# Altium project РЕУН.468323.001_Плата управления.PrjPCB
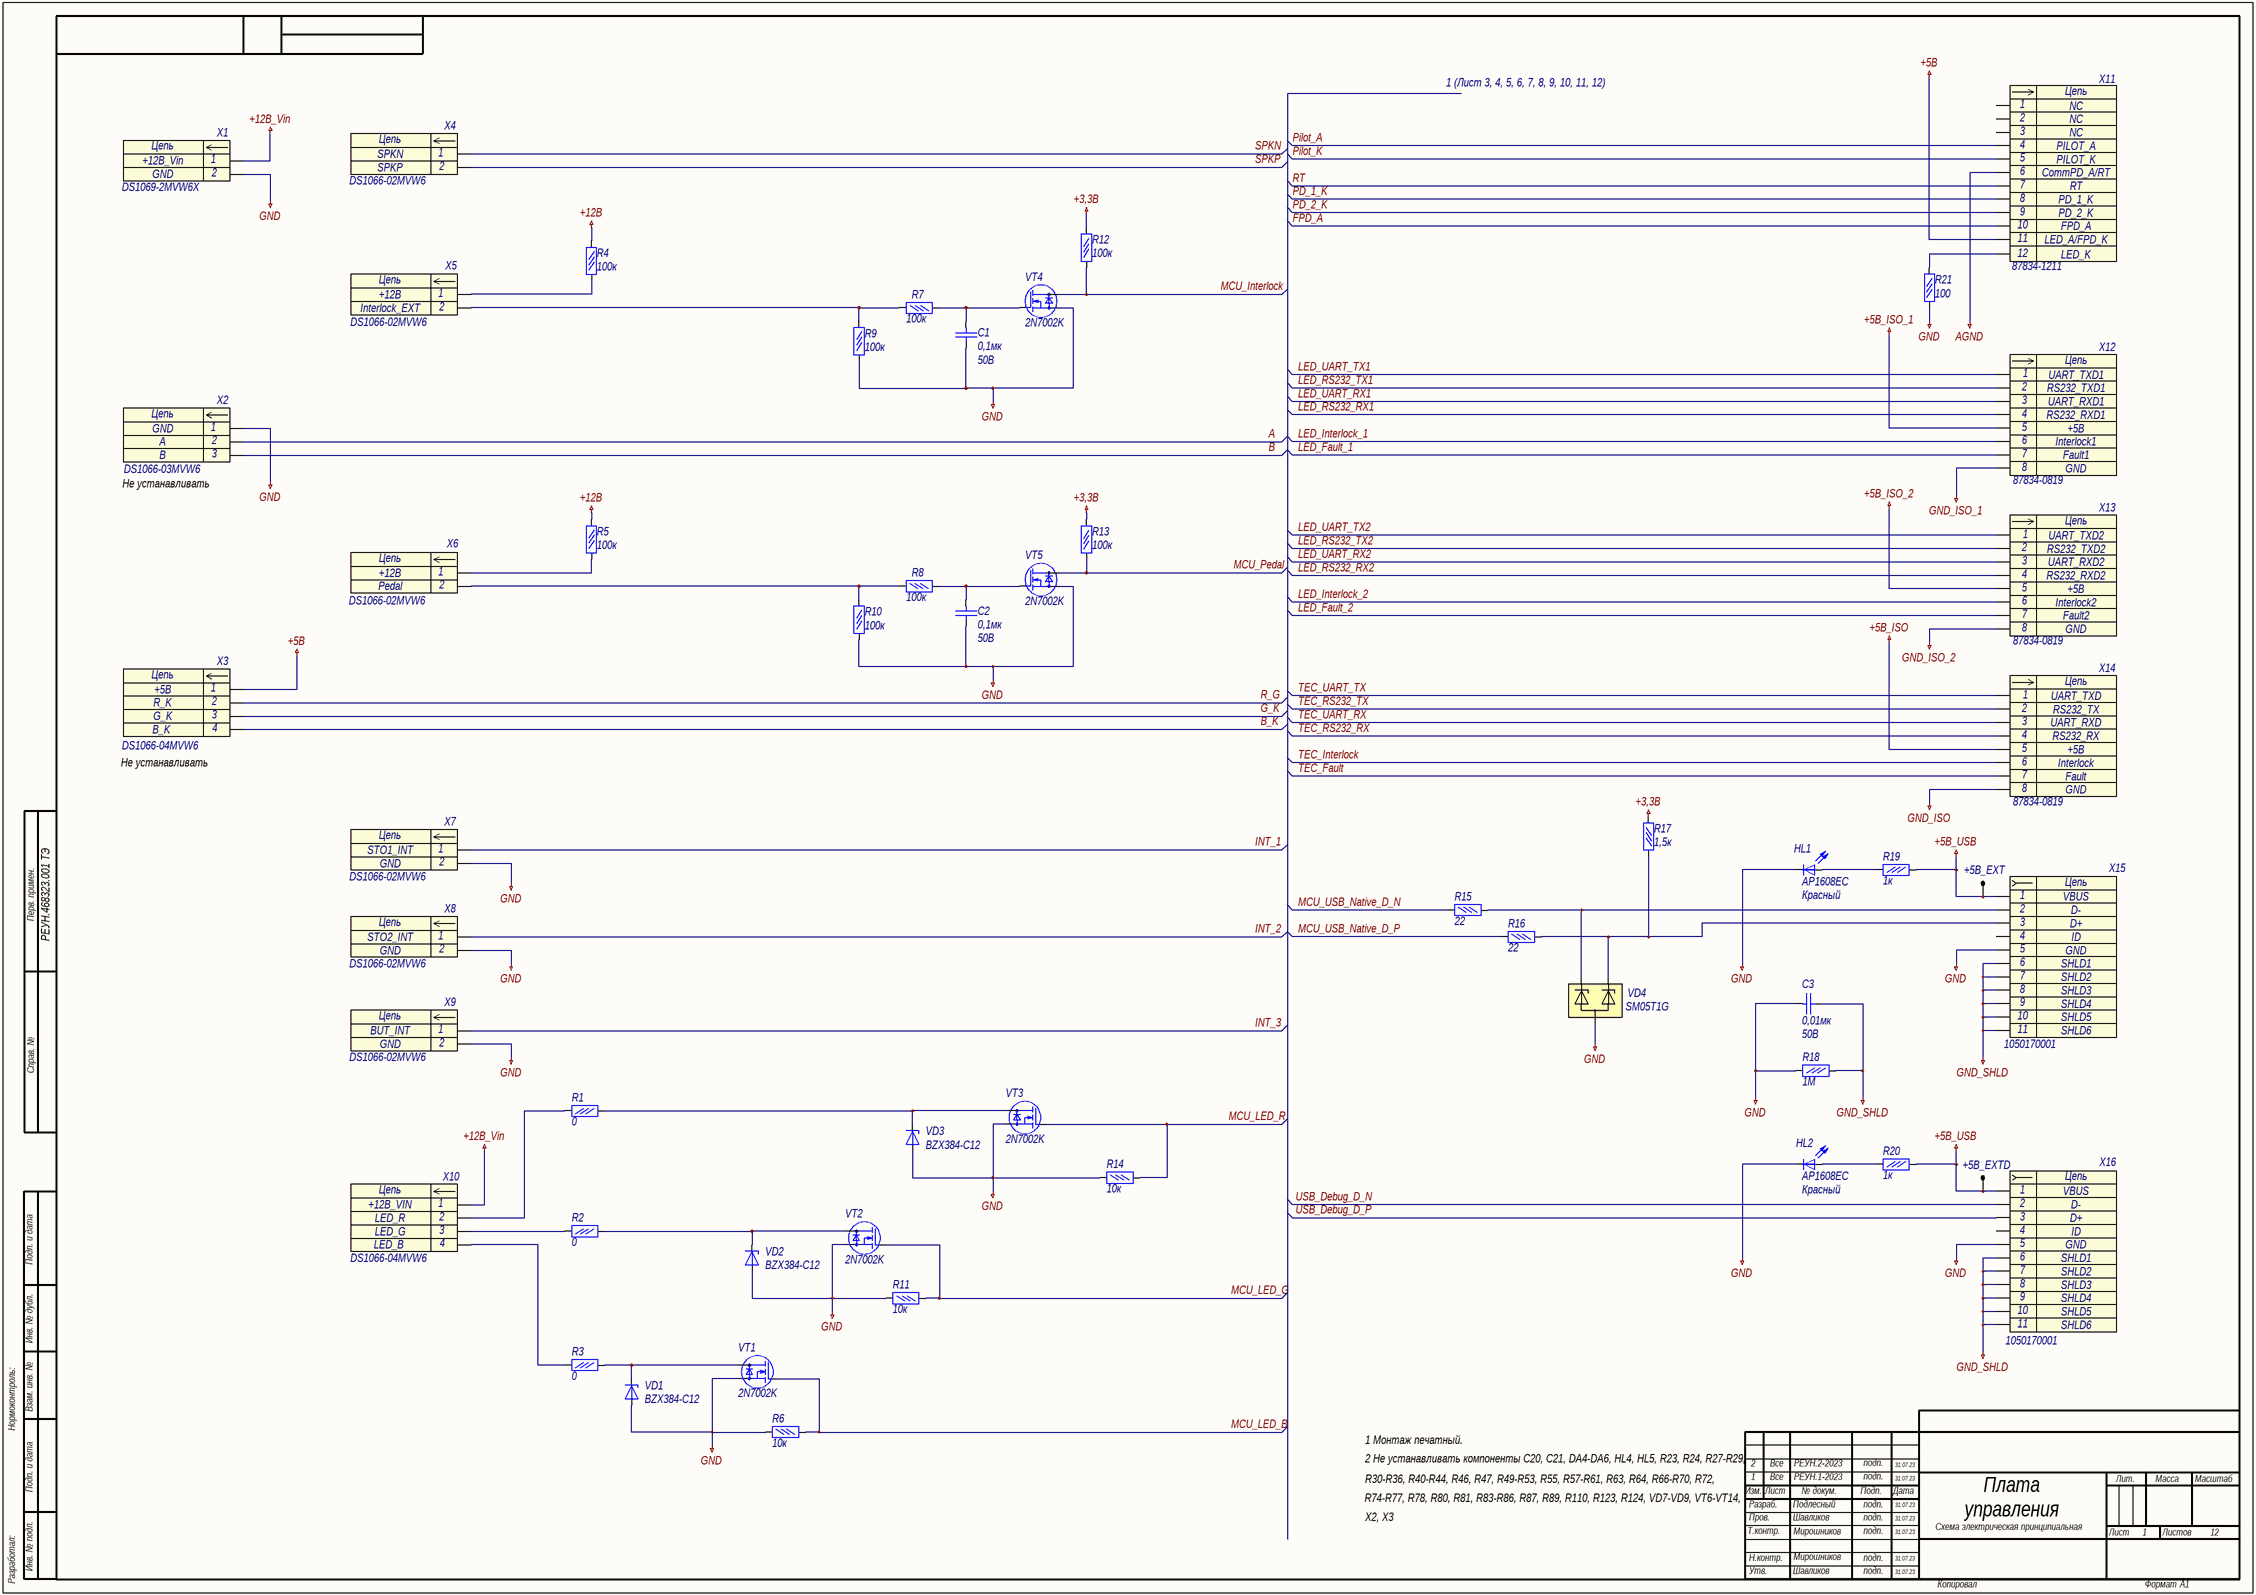
[diagram p0: РЕУН.468323.001_Connectors.SchDoc]
12 sheets, 278 parts. Net scope: global (net labels, ports and power ports of the same name join across sheets).
Sheets:
  РЕУН.468323.001_Connectors.SchDoc
  РЕУН.468323.001_Power.SchDoc
  РЕУН.468323.001_Interface.SchDoc
  РЕУН.468323.001_Encoder.SchDoc
  РЕУН.468323.001_Audio.SchDoc
  РЕУН.468323.001_LED_DRV_ISO_1.SchDoc
  РЕУН.468323.001_LED_DRV_ISO_2.SchDoc
  РЕУН.468323.001_LED_DRV_TEC.SchDoc
  РЕУН.468323.001_USB-UART.SchDoc
  РЕУН.468323.001_EEPROM.SchDoc
  РЕУН.468323.001_INT.SchDoc
  РЕУН.468323.001_Laser_Interface.SchDoc

## Sheet РЕУН.468323.001_Connectors.SchDoc: Плата
size 840 x 594 mm; ApprovedBy: Шавликов; CheckedBy: Шавликов; DrawnBy: Подлесный; SheetNumber: 1; SheetTotal: 12; Вид изделия: Документация; Раздел: Документация; Код документа: Э3; Вид документа: Схема электрическая принципиальная; Класс документа: Конструкторский документ; Создавать изделие в PLM: Yes; DocumentCode: РЕУН.468323.001 Э3 2D; DocumentView: Схема электрическая принципиальная; DocumentClass: Конструкторский документ; ProductView: Документация; DocName: Плата; Title_2: управления; DocumentType: Схема электрическая принципиальная; Format: А1; ImagePath: РЕУН.468323.001 ТЭ

### Parts
+5В_EXT  "1"  [0.5 x 1_round]  (value not drawn)
+5В_EXTD  "1"  [0.5 x 1_round]  (value not drawn)
C1  Voltage: 50В  [C0805_AA]  (hidden comment: 0,1мк)
C2  Voltage: 50В  [C0805_AA]  (hidden comment: 0,1мк)
C3  Voltage: 50В  [C0805_AA]  (hidden comment: 0,01мк)
HL1  Color: Красный  (hidden comment: AP1608EC)
HL2  Color: Красный  (hidden comment: AP1608EC)
R1  0  [R1206]
R2  0  [R1206]
R3  0  [R1206]
R4  100к  [R1206]
R5  100к  [R1206]
R6  10к  [R1206]
R7  100к  [R1206]
R8  100к  [R1206]
R9  100к  [R1206]
R10  100к  [R1206]
R11  10к  [R1206]
R12  100к  [R1206]
R13  100к  [R1206]
R14  10к  [R1206]
R15  22  [R1206]
R16  22  [R1206]
R17  1,5к  [R1206]
R18  1M  [R1206]
R19  1к  [R1206]
R20  1к  [R1206]
R21  100  [R1206]
VD1  BZX384-C12  [SOT23-2_A]
VD2  BZX384-C12  [SOT23-2_A]
VD3  BZX384-C12  [SOT23-2_A]
VD4  SM05T1G
VT1  2N7002K  [SOT23-3]
VT2  2N7002K  [SOT23-3]
VT3  2N7002K  [SOT23-3]
VT4  2N7002K  [SOT23-3]
VT5  2N7002K  [SOT23-3]
X1  DS1069-2MVW6X
X2  DS1066-03MVW6
X3  DS1066-04MVW6
X4  DS1066-02MVW6
X5  DS1066-02MVW6
X6  DS1066-02MVW6
X7  DS1066-02MVW6
X8  DS1066-02MVW6
X9  DS1066-02MVW6
X10  DS1066-04MVW6
X11  87834-1211
X12  87834-0819
X13  87834-0819
X14  87834-0819
X15  1050170001
X16  1050170001

### Nets
+3,3В: R12.1 R13.1 R17.2
+5В: X3.1 X11.10
+5В_ISO: X14.5
+5В_ISO_1: X12.5
+5В_ISO_2: X13.5
+5В_USB: +5В_EXT.1 +5В_EXTD.1 R19.2 R20.2 X15.1 X16.1
+12В: R4.2 R5.2
+12В_Vin: X1.1 X10.1
AGND: X11.6
GND: C1.1 C2.1 C3.2 HL1.2(K) HL2.2(K) R6.1 R9.1 R10.1 R11.2 R14.1 R18.1 R21.2 VD1.2(A) VD2.2(A) VD3.2(A) VD4.3 VT1.2(S) VT2.2(S) VT3.2(S) VT4.2(S) VT5.2(S) X1.2 X2.1 X7.2 X8.2 X9.2 X15.5 X16.5
GND_ISO: X14.8
GND_ISO_1: X12.8
GND_ISO_2: X13.8
GND_SHLD: C3.1 R18.2 X15.6 X15.7 X15.8 X15.9 X15.10 X16.6 X16.7 X16.8 X16.9 X16.10
A: X2.2
B: X2.2
B_K: X3.2
FPD_A: X11.10
G_K: X3.2
INT_1: X7.1
INT_2: X8.1
INT_3: X9.1
LED_Fault_1: X12.7
LED_Fault_2: X13.7
LED_Interlock_1: X12.6
LED_Interlock_2: X13.6
LED_RS232_RX1: X12.4
LED_RS232_RX2: X13.4
LED_RS232_TX1: X12.2
LED_RS232_TX2: X13.2
LED_UART_RX1: X12.3
LED_UART_RX2: X13.3
LED_UART_TX1: X12.1
LED_UART_TX2: X13.1
MCU_Interlock: R12.2 VT4.3(D)
MCU_LED_B: R6.2 VT1.1(G)
MCU_LED_G: R11.1 VT2.1(G)
MCU_LED_R: R14.2 VT3.1(G)
MCU_Pedal: R13.2 VT5.3(D)
MCU_USB_Native_D_N: R15.1
MCU_USB_Native_D_P: R16.1
PD_1_K: X11.8
PD_2_K: X11.9
Pilot_A: X11.4
Pilot_K: X11.5
R_G: X3.2
RT: X11.7
SPKN: X4.1
SPKP: X4.2
TEC_Fault: X14.7
TEC_Interlock: X14.6
TEC_RS232_RX: X14.4
TEC_RS232_TX: X14.2
TEC_UART_RX: X14.3
TEC_UART_TX: X14.1
USB_Debug_D_N: X16.2
USB_Debug_D_P: X16.3
NetC1_2: C1.2 R7.1 VT4.1(G)
NetC2_2: C2.2 R8.2 VT5.1(G)
NetHL1_1: HL1.1(A) R19.1
NetHL2_1: HL2.1(A) R20.1
NetR1_1: R1.1 VD3.1(K) VT3.3(D)
NetR1_2: R1.2 X10.2
NetR2_1: R2.1 VD2.1(K) VT2.3(D)
NetR2_2: R2.2 X10.2
NetR3_1: R3.1 VD1.1(K) VT1.3(D)
NetR3_2: R3.2 X10.2
NetR4_1: R4.1 X5.1
NetR5_1: R5.1 X6.1
NetR7_2: R7.2 R9.2 X5.2
NetR8_1: R8.1 R10.2 X6.2
NetR15_2: R15.2 VD4.1 X15.2
NetR16_2: R16.2 R17.1 VD4.2 X15.3
NetR21_1: R21.1 X11.10

Not connected (* = marked no-connect by the designer): X11 1 2 3; X15 4; X16 4

### Notes on the sheet
- 1 (Лист 3, 4, 5, 6, 7, 8, 9, 10, 11, 12)
- (near X2) Не устанавливать
- Не устанавливать
- 1 Монтаж печатный.
- 2 Не устанавливать компоненты C20, C21, DA4-DA6, HL4, HL5, R23, R24, R27-R29,
- 2
- Все
- РЕУН.2-2023
- подп.
- 31.07.23
- R74-R77, R78, R80, R81, R83-R86, R87, R89, R110, R123, R124, VD7-VD9, VT6-VT14,
- R30-R36, R40-R44, R46, R47, R49-R53, R55, R57-R61, R63, R64, R66-R70, R72,
- 1
- РЕУН.1-2023
- X2, X3
- Мирошников
- Перв. примен.
- Справ. №
- Подп. и дата
- Инв. № дубл.
- Нормоконтроль:
- Взам. инв. №
- Изм.
- Лист
- № докум.
- Подп.
- Дата
- Лит.
- Масса
- Масштаб
- Т.контр.
- Пров.
- Разраб.
- Листов
- Разработал:
- Инв. № подл.
- Н.контр.
- Утв.
- Копировал
- Формат
- (in symbol x8-m) Цепь
- (in symbol x8-m_1) Цепь
- (in symbol x8-m_1_1) Цепь
- (in symbol x8-m_1_1_1) Цепь
- (in symbol x10-m_1) Цепь; 11
- (in symbol x10-m_1_1) Цепь; 11; 12

### Library data of the parts
+5В_EXT +5В_EXTD = TestPoint: Test point; Comment_1: "1"
C1-C3 = Конденсатор кер.
  C1 C2: Value: 0,1мк
  C3: Value: 0,01мк
HL1 HL2 = led: Светодиод; Name: AP1608EC
R1-R21 = Резистор  0,05Вт: Резистор 0,05Вт; Power rating: 0,05Вт
  R1-R3: Value: 0
  R4 R5 R7-R10 R12 R13: Value: 100к
  R6 R11 R14: Value: 10к
  R15 R16: Value: 22
  R17: Value: 1,5к
  R18: Value: 1M
  R19 R20: Value: 1к
  R21: Value: 100
VD1-VD3 = DiodeZener: Стабилитрон; Name: BZX384-C12
VD4 = ZenerArray2: Сборка TVS-диодов
VT1-VT5 = mosfet-n: Name: 2N7002K
X1 = x8-m_1: Разъем - 8 конт. вилка; Contact_1: +12В_Vin; Contact_2: GND; Contact_3: Contact_3; Contact_4: Contact_4; Contact_5: Contact_5; Contact_6: Contact_6; Contact_7: Contact_7; Contact_8: Contact_8; Name: DS1069-2MVW6X
X2 = x8-m_1_1: Разъем - 8 конт. вилка; Contact_1: GND; Contact_2: A; Contact_3: B; Contact_4: Contact_4; Contact_5: Contact_5; Contact_6: Contact_6; Contact_7: Contact_7; Contact_8: Contact_8; Name: DS1066-03MVW6
X3 = x8-m_1_1_1: Разъем - 8 конт. вилка; Contact_1: +5В; Contact_2: R_K; Contact_3: G_K; Contact_4: B_K; Contact_5: Contact_5; Contact_6: Contact_6; Contact_7: Contact_7; Contact_8: Contact_8; Name: DS1066-04MVW6
X4 = x8-m_1: Разъем - 8 конт. вилка; Contact_1: SPKN; Contact_2: SPKP; Contact_3: Contact_3; Contact_4: Contact_4; Contact_5: Contact_5; Contact_6: Contact_6; Contact_7: Contact_7; Contact_8: Contact_8; Name: DS1066-02MVW6
X5 = x8-m_1: Разъем - 8 конт. вилка; Contact_1: +12В; Contact_2: Interlock_EXT; Contact_3: Contact_3; Contact_4: Contact_4; Contact_5: Contact_5; Contact_6: Contact_6; Contact_7: Contact_7; Contact_8: Contact_8; Name: DS1066-02MVW6
X6 = x8-m_1: Разъем - 8 конт. вилка; Contact_1: +12В; Contact_2: Pedal; Contact_3: Contact_3; Contact_4: Contact_4; Contact_5: Contact_5; Contact_6: Contact_6; Contact_7: Contact_7; Contact_8: Contact_8; Name: DS1066-02MVW6
X7 = x8-m_1: Разъем - 8 конт. вилка; Contact_1: STO1_INT; Contact_2: GND; Contact_3: Contact_3; Contact_4: Contact_4; Contact_5: Contact_5; Contact_6: Contact_6; Contact_7: Contact_7; Contact_8: Contact_8; Name: DS1066-02MVW6
X8 = x8-m_1: Разъем - 8 конт. вилка; Contact_1: STO2_INT; Contact_2: GND; Contact_3: Contact_3; Contact_4: Contact_4; Contact_5: Contact_5; Contact_6: Contact_6; Contact_7: Contact_7; Contact_8: Contact_8; Name: DS1066-02MVW6
X9 = x8-m_1: Разъем - 8 конт. вилка; Contact_1: BUT_INT; Contact_2: GND; Contact_3: Contact_3; Contact_4: Contact_4; Contact_5: Contact_5; Contact_6: Contact_6; Contact_7: Contact_7; Contact_8: Contact_8; Name: DS1066-02MVW6
X10 = x8-m_1_1_1: Разъем - 8 конт. вилка; Contact_1: +12В_VIN; Contact_2: LED_R; Contact_3: LED_G; Contact_4: LED_B; Contact_5: Contact_5; Contact_6: Contact_6; Contact_7: Contact_7; Contact_8: Contact_8; Name: DS1066-04MVW6
X11 = x10-m_1_1: Разъем - 10 конт. вилка; Contact_1: NC; Contact_4: PILOT_A; Contact_5: PILOT_K; Contact_6: CommPD_A/RT; Contact_7: RT; Contact_8: PD_1_K; Contact_9: PD_2_K; Contact_10: FPD_A; Contact_11: LED_A/FPD_K; Contact_12: LED_K; Contact_2: NC; Contact_3: NC; Name: 87834-1211
X12 = x8-m: Разъем - 8 конт. вилка; Contact_1: UART_TXD1; Contact_2: RS232_TXD1; Contact_3: UART_RXD1; Contact_4: RS232_RXD1; Contact_5: +5В; Contact_6: Interlock1; Contact_7: Fault1; Contact_8: GND; Name: 87834-0819
X13 = x8-m: Разъем - 8 конт. вилка; Contact_1: UART_TXD2; Contact_2: RS232_TXD2; Contact_3: UART_RXD2; Contact_4: RS232_RXD2; Contact_5: +5В; Contact_6: Interlock2; Contact_7: Fault2; Contact_8: GND; Name: 87834-0819
X14 = x8-m: Разъем - 8 конт. вилка; Contact_1: UART_TXD; Contact_2: RS232_TX; Contact_3: UART_RXD; Contact_4: RS232_RX; Contact_5: +5В; Contact_6: Interlock; Contact_7: Fault; Contact_8: GND; Name: 87834-0819
X15 X16 = x10-m_1: Разъем - 10 конт. вилка; Contact_1: VBUS; Contact_2: D-; Contact_3: D+; Contact_4: ID; Contact_5: GND; Contact_6: SHLD1; Contact_7: SHLD2; Contact_8: SHLD3; Contact_9: SHLD4; Contact_10: SHLD5; Contact_11: SHLD6; Name: 1050170001

## Sheet РЕУН.468323.001_Power.SchDoc: =Name-1str
size 420 x 297 mm; SheetNumber: 2; Вид изделия: Документация; Раздел: Документация; Код документа: РЕУН.468323.001Э3; Вид документа: Схема электрическая принципиальная; Класс документа: Конструкторский документ; Создавать изделие в PLM: Yes; DocumentCode: РЕУН.468323.001 Э3 2D; DocumentView: Схема электрическая принципиальная; DocumentClass: Конструкторский документ; ProductView: Документация; Format: А3
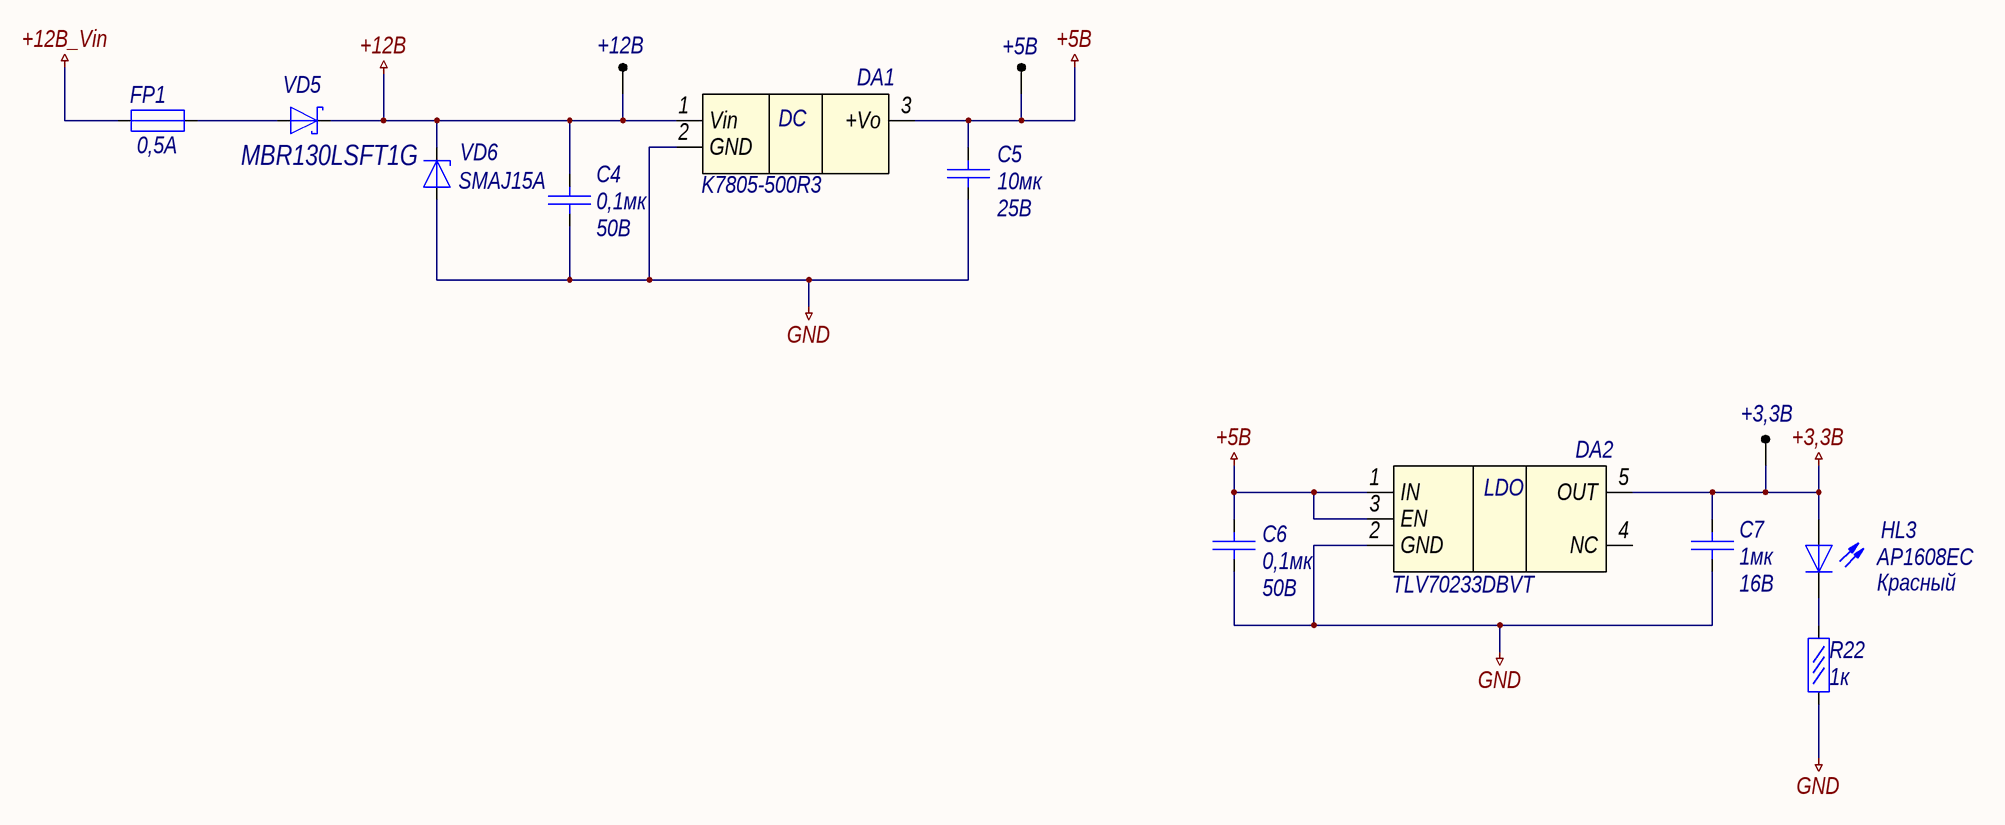
[diagram p1: РЕУН.468323.001_Power.SchDoc]

### Parts
+3,3В  "1"  [0.5 x 1_round]  (value not drawn)
+5В  "1"  [0.5 x 1_round]  (value not drawn)
+12В  "1"  [0.5 x 1_round]  (value not drawn)
C4  Voltage: 50В  [C0805_AA]  (hidden comment: 0,1мк)
C5  Voltage: 25В  [C0805_AA]  (hidden comment: 10мк)
C6  Voltage: 50В  [C0805_AA]  (hidden comment: 0,1мк)
C7  Voltage: 16В  [C0805_AA]  (hidden comment: 1мк)
DA1  K7805-500R3
DA2  TLV70233DBVT
FP1  value 0,5А  [R0805_H]
HL3  Vf: Красный  [D0603_A]  (hidden comment: AP1608EC)
R22  1к  [R1206]
VD5  MBR130LSFT1G  [SOD123_A]
VD6  SMAJ15A  [SOT23-2_A]

### Nets
+3,3В: +3,3В.1 C7.2 DA2.5(OUT) HL3.1(Анод)
+5В: +5В.1 C5.2 C6.2 DA1.3(+Vo) DA2.1(IN) DA2.3(EN)
+12В: +12В.1 C4.2 DA1.1(Vin) VD5.1(K) VD6.1(K)
+12В_Vin: FP1.1
GND: C4.1 C5.1 C6.1 C7.1 DA1.2(GND) DA2.2(GND) R22.1 VD6.2(A)
NetFP1_2: FP1.2 VD5.2(A)
NetHL3_2: HL3.2(Катод) R22.2

Not connected (* = marked no-connect by the designer): DA2 4(NC)

### Notes on the sheet
- Подп. и дата
- Инв. № дубл.
- Взам. инв. №
- Инв. № подл.
- Лист
- Изм.
- № докум.
- Подп.
- Дата
- Копировал
- Формат
- (in symbol K78xx-500R3) DC
- (in symbol TLV702) LDO

### Library data of the parts
+3,3В +5В +12В = TestPoint: Test point; Comment_1: "1"
C4-C7 = Конденсатор кер.
  C4 C6: Value: 0,1мк
  C5: Value: 10мк
  C7: Value: 1мк
DA1 = K78xx-500R3: DC/DC преобразователь неизолированный
DA2 = TLV702: LDO Regulator
FP1 = Fuse: Предохранитель
HL3 = LED_R: Светодиод; Name: AP1608EC
R22 = Резистор  0,05Вт: Резистор 0,05Вт; Power rating: 0,05Вт; Value: 1к
VD5 = DiodeSchottky: Диод Шоттки; Name: MBR130LSFT1G
VD6 = DiodeZener: Стабилитрон; Name: SMAJ15A

## Sheet РЕУН.468323.001_Interface.SchDoc: =Name-1str
size 840 x 594 mm; SheetNumber: 3; Вид изделия: Документация; Раздел: Документация; Код документа: Э3; Вид документа: Схема электрическая принципиальная; Класс документа: Конструкторский документ; Создавать изделие в PLM: Yes; DocumentCode: РЕУН.468323.001 Э3 2D; DocumentView: Схема электрическая принципиальная; DocumentClass: Конструкторский документ; ProductView: Документация; Format: А1
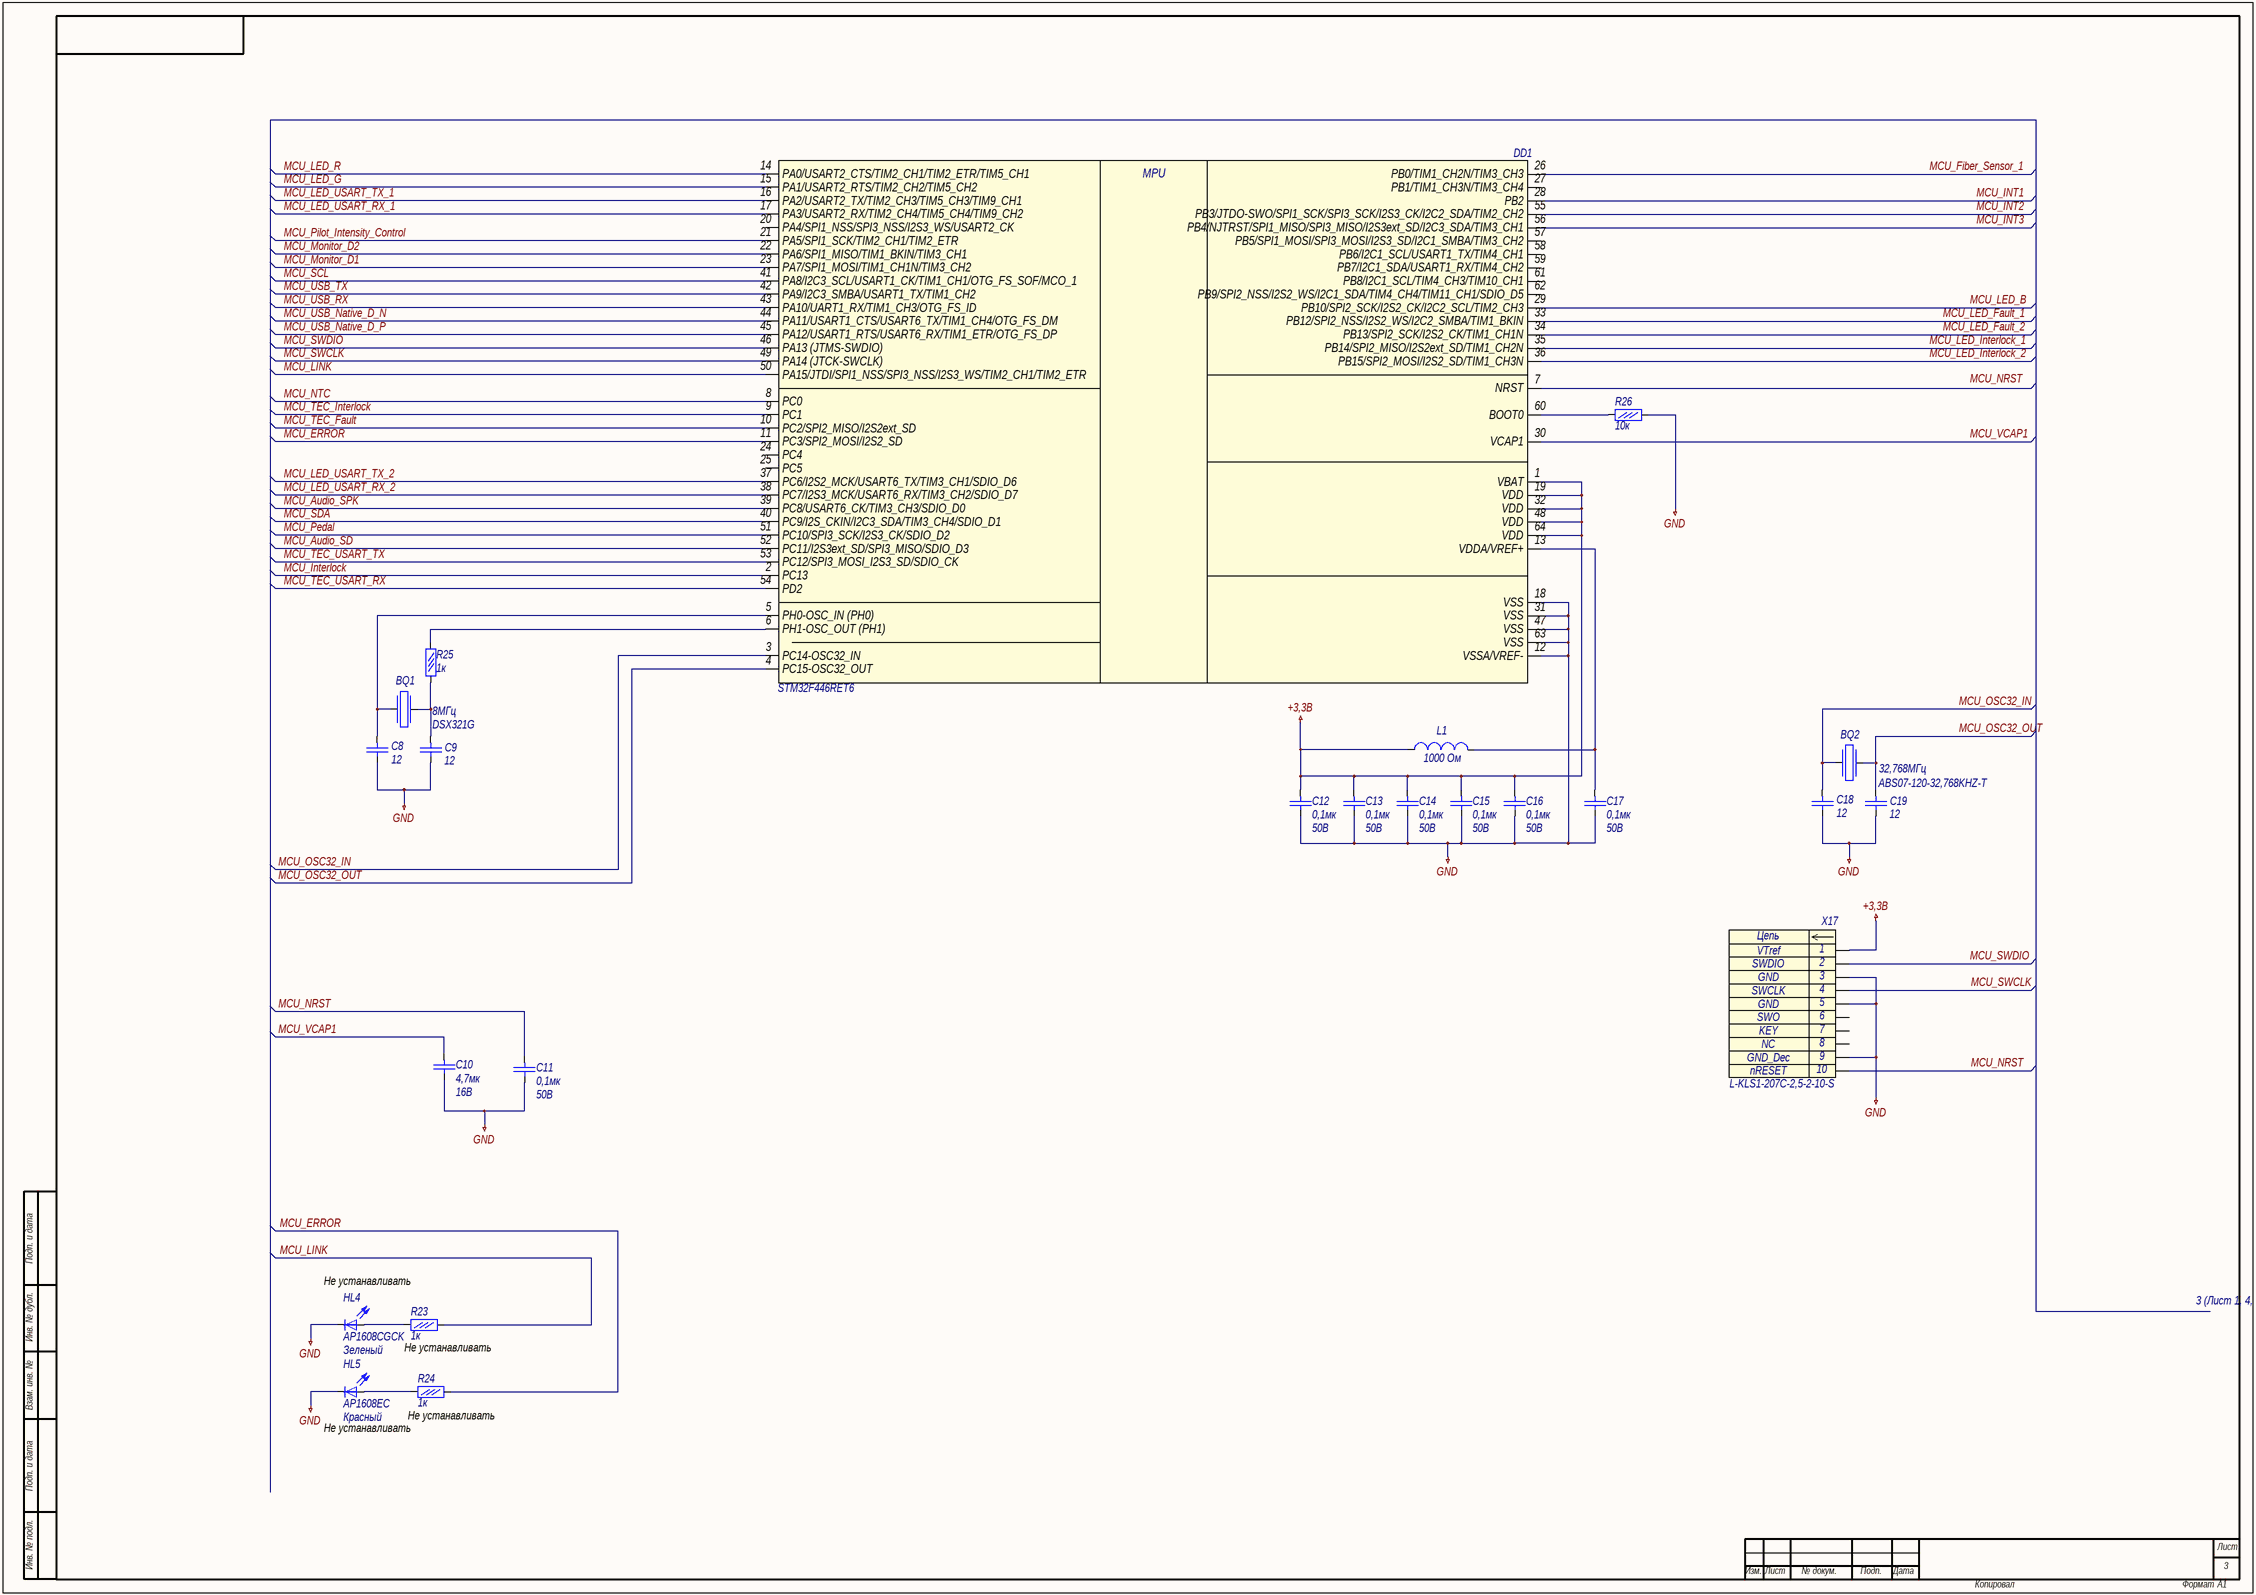
[diagram p2: РЕУН.468323.001_Interface.SchDoc]

### Parts
BQ1  Name: DSX321G  [QSMD3.2x2.5_A]  (hidden comment: 8МГц)
BQ2  Name: ABS07-120-32,768KHZ-T  [QSMD3.2x2.5_A]  (hidden comment: 32,768МГц)
C8  12  [C0805_AA]
C9  12  [C0805_AA]
C10  Voltage: 16В  [C0805_AA]  (hidden comment: 4,7мк)
C11  Voltage: 50В  [C0805_AA]  (hidden comment: 0,1мк)
C12  Voltage: 50В  [C0805_AA]  (hidden comment: 0,1мк)
C13  Voltage: 50В  [C0805_AA]  (hidden comment: 0,1мк)
C14  Voltage: 50В  [C0805_AA]  (hidden comment: 0,1мк)
C15  Voltage: 50В  [C0805_AA]  (hidden comment: 0,1мк)
C16  Voltage: 50В  [C0805_AA]  (hidden comment: 0,1мк)
C17  Voltage: 50В  [C0805_AA]  (hidden comment: 0,1мк)
C18  12  [C0805_AA]
C19  12  [C0805_AA]
DD1  STM32F446RET6
HL4  Color: Зеленый  (hidden comment: AP1608CGCK)
HL5  Color: Красный  (hidden comment: AP1608EC)
L1  1000 Ом  [L0603_A]
R23  1к  [R1206]
R24  1к  [R1206]
R25  1к  [R1206]
R26  10к  [R1206]
X17  L-KLS1-207C-2,5-2-10-S

### Nets
+3,3В: C12.2 C13.2 C14.2 C15.2 C16.2 DD1.1(VBAT) DD1.19(VDD) DD1.32(VDD) DD1.48(VDD) DD1.64(VDD) L1.1 X17.1
GND: C8.1 C9.1 C10.1 C11.1 C12.1 C13.1 C14.1 C15.1 C16.1 C17.1 C18.1 C19.1 DD1.12(VSSA/VREF-) DD1.18(VSS) DD1.31(VSS) DD1.47(VSS) DD1.63(VSS) HL4.2(K) HL5.2(K) R26.1 X17.3 X17.5 X17.9
MCU_Audio_SD: DD1.52(PC11/I2S3ext_SD/SPI3_MISO/SDIO_D3)
MCU_Audio_SPK: DD1.39(PC8/USART6_CK/TIM3_CH3/SDIO_D0)
MCU_ERROR: DD1.11(PC3/SPI2_MOSI/I2S2_SD) R24.1
MCU_Fiber_Sensor_1: DD1.26(PB0/TIM1_CH2N/TIM3_CH3)
MCU_INT1: DD1.28(PB2)
MCU_INT2: DD1.55(PB3/JTDO-SWO/SPI1_SCK/SPI3_SCK/I2S3_CK/I2C2_SDA/TIM2_CH2)
MCU_INT3: DD1.56(PB4/NJTRST/SPI1_MISO/SPI3_MISO/I2S3ext_SD/I2C3_SDA/TIM3_CH1)
MCU_Interlock: DD1.2(PC13)
MCU_LED_B: DD1.29(PB10/SPI2_SCK/I2S2_CK/I2C2_SCL/TIM2_CH3)
MCU_LED_Fault_1: DD1.33(PB12/SPI2_NSS/I2S2_WS/I2C2_SMBA/TIM1_BKIN)
MCU_LED_Fault_2: DD1.34(PB13/SPI2_SCK/I2S2_CK/TIM1_CH1N)
MCU_LED_G: DD1.15(PA1/USART2_RTS/TIM2_CH2/TIM5_CH2)
MCU_LED_Interlock_1: DD1.35(PB14/SPI2_MISO/I2S2ext_SD/TIM1_CH2N)
MCU_LED_Interlock_2: DD1.36(PB15/SPI2_MOSI/I2S2_SD/TIM1_CH3N)
MCU_LED_R: DD1.14(PA0/USART2_CTS/TIM2_CH1/TIM2_ETR/TIM5_CH1)
MCU_LED_USART_RX_1: DD1.17(PA3/USART2_RX/TIM2_CH4/TIM5_CH4/TIM9_CH2)
MCU_LED_USART_RX_2: DD1.38(PC7/I2S3_MCK/USART6_RX/TIM3_CH2/SDIO_D7)
MCU_LED_USART_TX_1: DD1.16(PA2/USART2_TX/TIM2_CH3/TIM5_CH3/TIM9_CH1)
MCU_LED_USART_TX_2: DD1.37(PC6/I2S2_MCK/USART6_TX/TIM3_CH1/SDIO_D6)
MCU_LINK: DD1.50(PA15/JTDI/SPI1_NSS/SPI3_NSS/I2S3_WS/TIM2_CH1/TIM2_ETR) R23.1
MCU_Monitor_D1: DD1.23(PA7/SPI1_MOSI/TIM1_CH1N/TIM3_CH2)
MCU_Monitor_D2: DD1.22(PA6/SPI1_MISO/TIM1_BKIN/TIM3_CH1)
MCU_NRST: C11.2 X17.10
MCU_NTC: DD1.8(PC0)
MCU_OSC32_IN: BQ2.2 C18.2 DD1.3(PC14-OSC32_IN)
MCU_OSC32_OUT: BQ2.1 C19.2 DD1.4(PC15-OSC32_OUT)
MCU_Pedal: DD1.51(PC10/SPI3_SCK/I2S3_CK/SDIO_D2)
MCU_Pilot_Intensity_Control: DD1.21(PA5/SPI1_SCK/TIM2_CH1/TIM2_ETR)
MCU_SCL: DD1.41(PA8/I2C3_SCL/USART1_CK/TIM1_CH1/OTG_FS_SOF/MCO_1)
MCU_SDA: DD1.40(PC9/I2S_CKIN/I2C3_SDA/TIM3_CH4/SDIO_D1)
MCU_SWCLK: DD1.49(PA14_(JTCK-SWCLK)) X17.4
MCU_SWDIO: DD1.46(PA13_(JTMS-SWDIO)) X17.2
MCU_TEC_Fault: DD1.10(PC2/SPI2_MISO/I2S2ext_SD)
MCU_TEC_Interlock: DD1.9(PC1)
MCU_TEC_USART_RX: DD1.54(PD2)
MCU_TEC_USART_TX: DD1.53(PC12/SPI3_MOSI_I2S3_SD/SDIO_CK)
MCU_USB_Native_D_N: DD1.44(PA11/USART1_CTS/USART6_TX/TIM1_CH4/OTG_FS_DM)
MCU_USB_Native_D_P: DD1.45(PA12/USART1_RTS/USART6_RX/TIM1_ETR/OTG_FS_DP)
MCU_USB_RX: DD1.43(PA10/UART1_RX/TIM1_CH3/OTG_FS_ID)
MCU_USB_TX: DD1.42(PA9/I2C3_SMBA/USART1_TX/TIM1_CH2)
MCU_VCAP1: C10.2 DD1.30(VCAP1)
NetBQ1_1: BQ1.1 C8.2 DD1.5(PH0-OSC_IN_(PH0))
NetBQ1_2: BQ1.2 C9.2 R25.1
NetC17_2: C17.2 DD1.13(VDDA/VREF+) L1.2
NetDD1_6: DD1.6(PH1-OSC_OUT_(PH1)) R25.2
NetDD1_60: DD1.60(BOOT0) R26.2
NetHL4_1: HL4.1(A) R23.2
NetHL5_1: HL5.1(A) R24.2

Not connected (* = marked no-connect by the designer): DD1 7(NRST) 20(PA4/SPI1_NSS/SPI3_NSS/I2S3_WS/USART2_CK) 24(PC4) 25(PC5) 27(PB1/TIM1_CH3N/TIM3_CH4) 57(PB5/SPI1_MOSI/SPI3_MOSI/I2S3_SD/I2C1_SMBA/TIM3_CH2) 58(PB6/I2C1_SCL/USART1_TX/TIM4_CH1) 59(PB7/I2C1_SDA/USART1_RX/TIM4_CH2) 61(PB8/I2C1_SCL/TIM4_CH3/TIM10_CH1) 62(PB9/SPI2_NSS/I2S2_WS/I2C1_SDA/TIM4_CH4/TIM11_CH1/SDIO_D5); X17 6 7 8

### Notes on the sheet
- Не устанавливать
- 3 (Лист 1, 4, 5, 6, 7, 8, 9, 10, 11, 12)
- (near R23) Не устанавливать
- (near R24) Не устанавливать
- Labels drawn without touching a wire or pin: MCU_NRST
- Подп. и дата
- Инв. № дубл.
- Взам. инв. №
- Инв. № подл.
- Лист
- Изм.
- № докум.
- Подп.
- Дата
- Копировал
- Формат
- (in symbol STM32F401RET6) MPU
- (in symbol x10-m) Цепь

### Library data of the parts
BQ1 BQ2 = Crystal: Кварцевый резонатор
  BQ1: Value: 8МГц
  BQ2: Value: 32,768МГц
C8-C19 = Конденсатор кер.
  C8 C9 C18 C19: Value: 12
  C10: Value: 4,7мк
  C11-C17: Value: 0,1мк
DD1 = STM32F401RET6: 32-битный микроконтроллер
HL4 HL5 = led: Светодиод
  HL4: Name: AP1608CGCK
  HL5: Name: AP1608EC
L1 = Inductor: Катушка индуктивности; Value: 1000 Ом
R23-R26 = Резистор  0,05Вт: Резистор 0,05Вт; Power rating: 0,05Вт
  R23-R25: Value: 1к
  R26: Value: 10к
X17 = x10-m: Разъем - 10 конт. вилка; Contact_1: VTref; Contact_2: SWDIO; Contact_3: GND; Contact_4: SWCLK; Contact_6: SWO; Contact_7: KEY; Contact_8: NC; Contact_9: GND_Dec; Contact_10: nRESET; Contact_5: GND; Name: L-KLS1-207C-2,5-2-10-S

## Sheet РЕУН.468323.001_Encoder.SchDoc: =Name-1str
size 420 x 297 mm; SheetNumber: 4; Вид изделия: Документация; Раздел: Документация; Код документа: Э3; Вид документа: Схема электрическая принципиальная; Класс документа: Конструкторский документ; Создавать изделие в PLM: Yes; DocumentCode: РЕУН.468323.001 Э3 2D; DocumentView: Схема электрическая принципиальная; DocumentClass: Конструкторский документ; ProductView: Документация; Format: А3
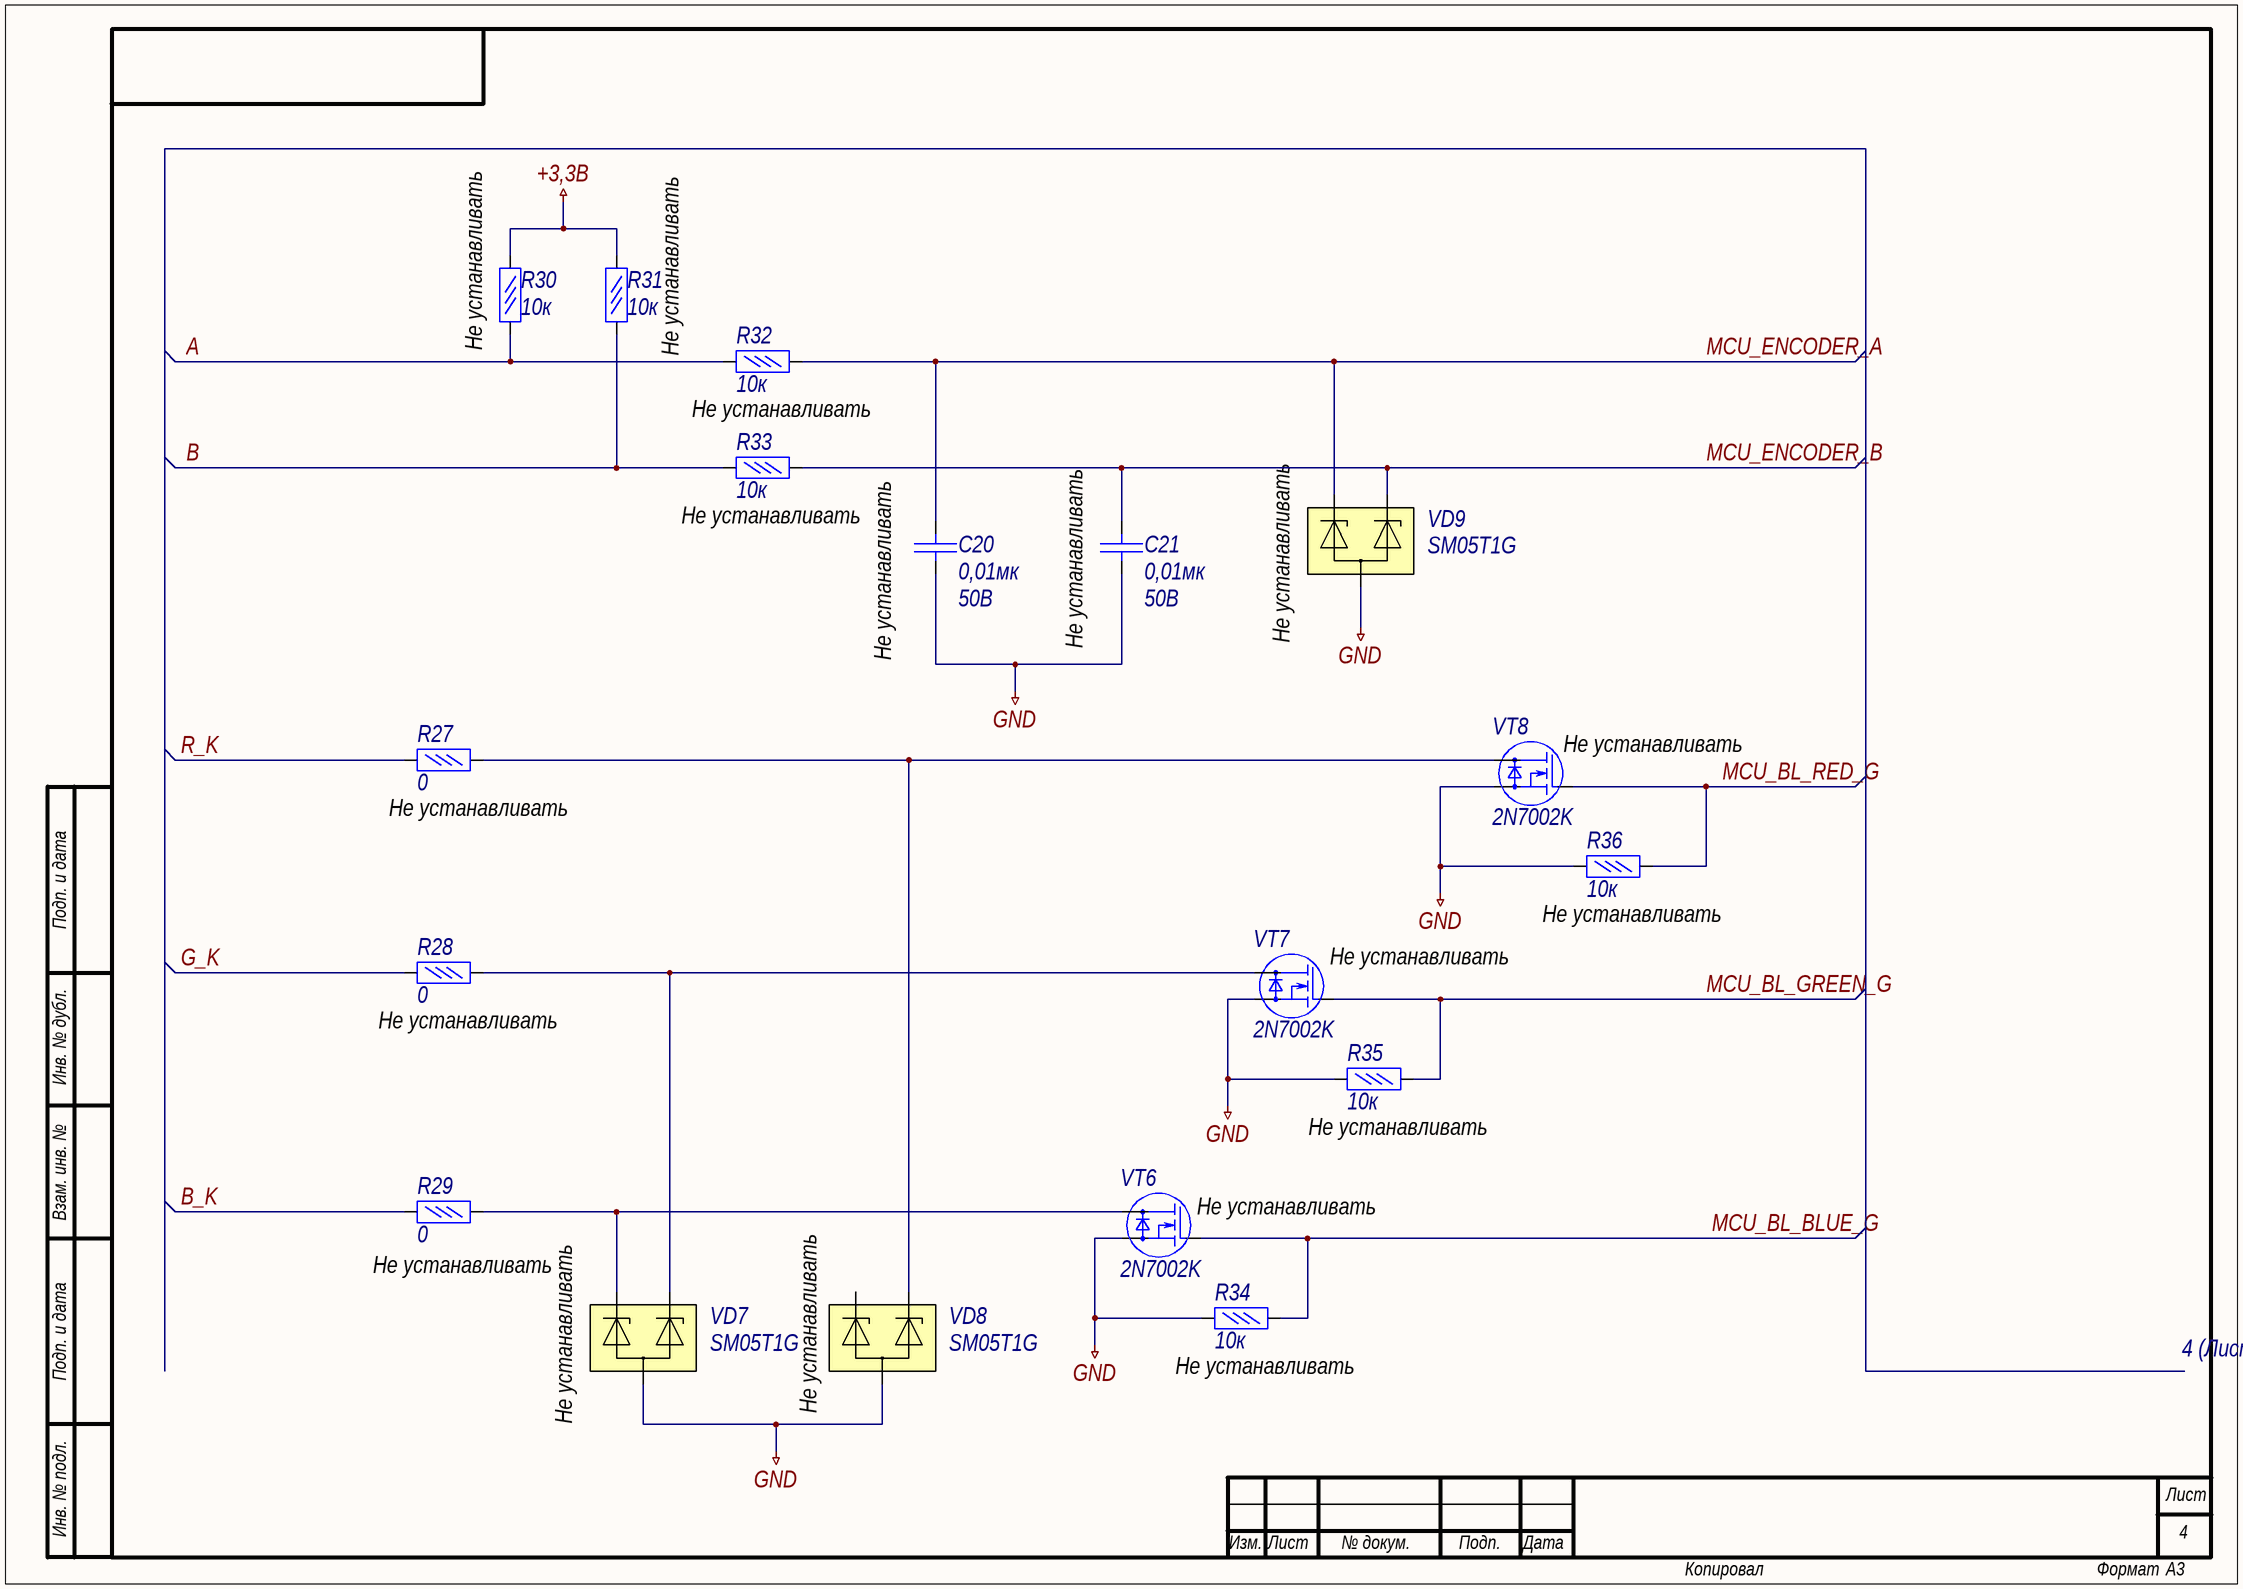
[diagram p3: РЕУН.468323.001_Encoder.SchDoc]

### Parts
C20  Voltage: 50В  [C0805_AA]  (hidden comment: 0,01мк)
C21  Voltage: 50В  [C0805_AA]  (hidden comment: 0,01мк)
R27  0  [R1206]
R28  0  [R1206]
R29  0  [R1206]
R30  10к  [R1206]
R31  10к  [R1206]
R32  10к  [R1206]
R33  10к  [R1206]
R34  10к  [R1206]
R35  10к  [R1206]
R36  10к  [R1206]
VD7  SM05T1G
VD8  SM05T1G
VD9  SM05T1G
VT6  2N7002K  [SOT23-3]
VT7  2N7002K  [SOT23-3]
VT8  2N7002K  [SOT23-3]

### Nets
+3,3В: R30.2 R31.2
GND: C20.1 C21.1 R34.1 R35.1 R36.1 VD7.3 VD8.3 VD9.3 VT6.2(S) VT7.2(S) VT8.2(S)
A: R30.1 R32.1
B: R31.1 R33.1
B_K: R29.1
G_K: R28.1
MCU_BL_BLUE_G: R34.2 VT6.1(G)
MCU_BL_GREEN_G: R35.2 VT7.1(G)
MCU_BL_RED_G: R36.2 VT8.1(G)
MCU_ENCODER_A: C20.2 R32.2 VD9.1
MCU_ENCODER_B: C21.2 R33.2 VD9.2
R_K: R27.1
NetR27_2: R27.2 VD8.2 VT8.3(D)
NetR28_2: R28.2 VD7.2 VT7.3(D)
NetR29_2: R29.2 VD7.1 VT6.3(D)

Not connected (* = marked no-connect by the designer): VD8 1

### Notes on the sheet
- (near R30) Не устанавливать
- Не устанавливать
- (near R33) Не устанавливать
- (near C20) Не устанавливать
- (near C21) Не устанавливать
- (near VD9) Не устанавливать
- (near VT8) Не устанавливать
- (near R27) Не устанавливать
- (near R36) Не устанавливать
- (near VT7) Не устанавливать
- (near R28) Не устанавливать
- (near R35) Не устанавливать
- (near VT6) Не устанавливать
- (near VD8) Не устанавливать
- (near R34) Не устанавливать
- 4 (Лист 1, 3, 5, 6, 7, 8, 9, 10, 11, 12)
- (near VD7) Не устанавливать
- Подп. и дата
- Инв. № дубл.
- Взам. инв. №
- Инв. № подл.
- Лист
- Изм.
- № докум.
- Подп.
- Дата
- Копировал
- Формат

### Library data of the parts
C20 C21 = Конденсатор кер.: Value: 0,01мк
R27-R36 = Резистор  0,05Вт: Резистор 0,05Вт; Power rating: 0,05Вт
  R27-R29: Value: 0
  R30-R36: Value: 10к
VD7-VD9 = ZenerArray2: Сборка TVS-диодов; Parameter 1: *
VT6-VT8 = mosfet-n: Name: 2N7002K

## Sheet РЕУН.468323.001_Audio.SchDoc: =Name-1str
size 420 x 297 mm; SheetNumber: 5; Вид изделия: Документация; Раздел: Документация; Код документа: Э3; Вид документа: Схема электрическая принципиальная; Класс документа: Конструкторский документ; Создавать изделие в PLM: Yes; DocumentCode: РЕУН.468323.001 Э3 2D; DocumentView: Схема электрическая принципиальная; DocumentClass: Конструкторский документ; ProductView: Документация; Format: А3
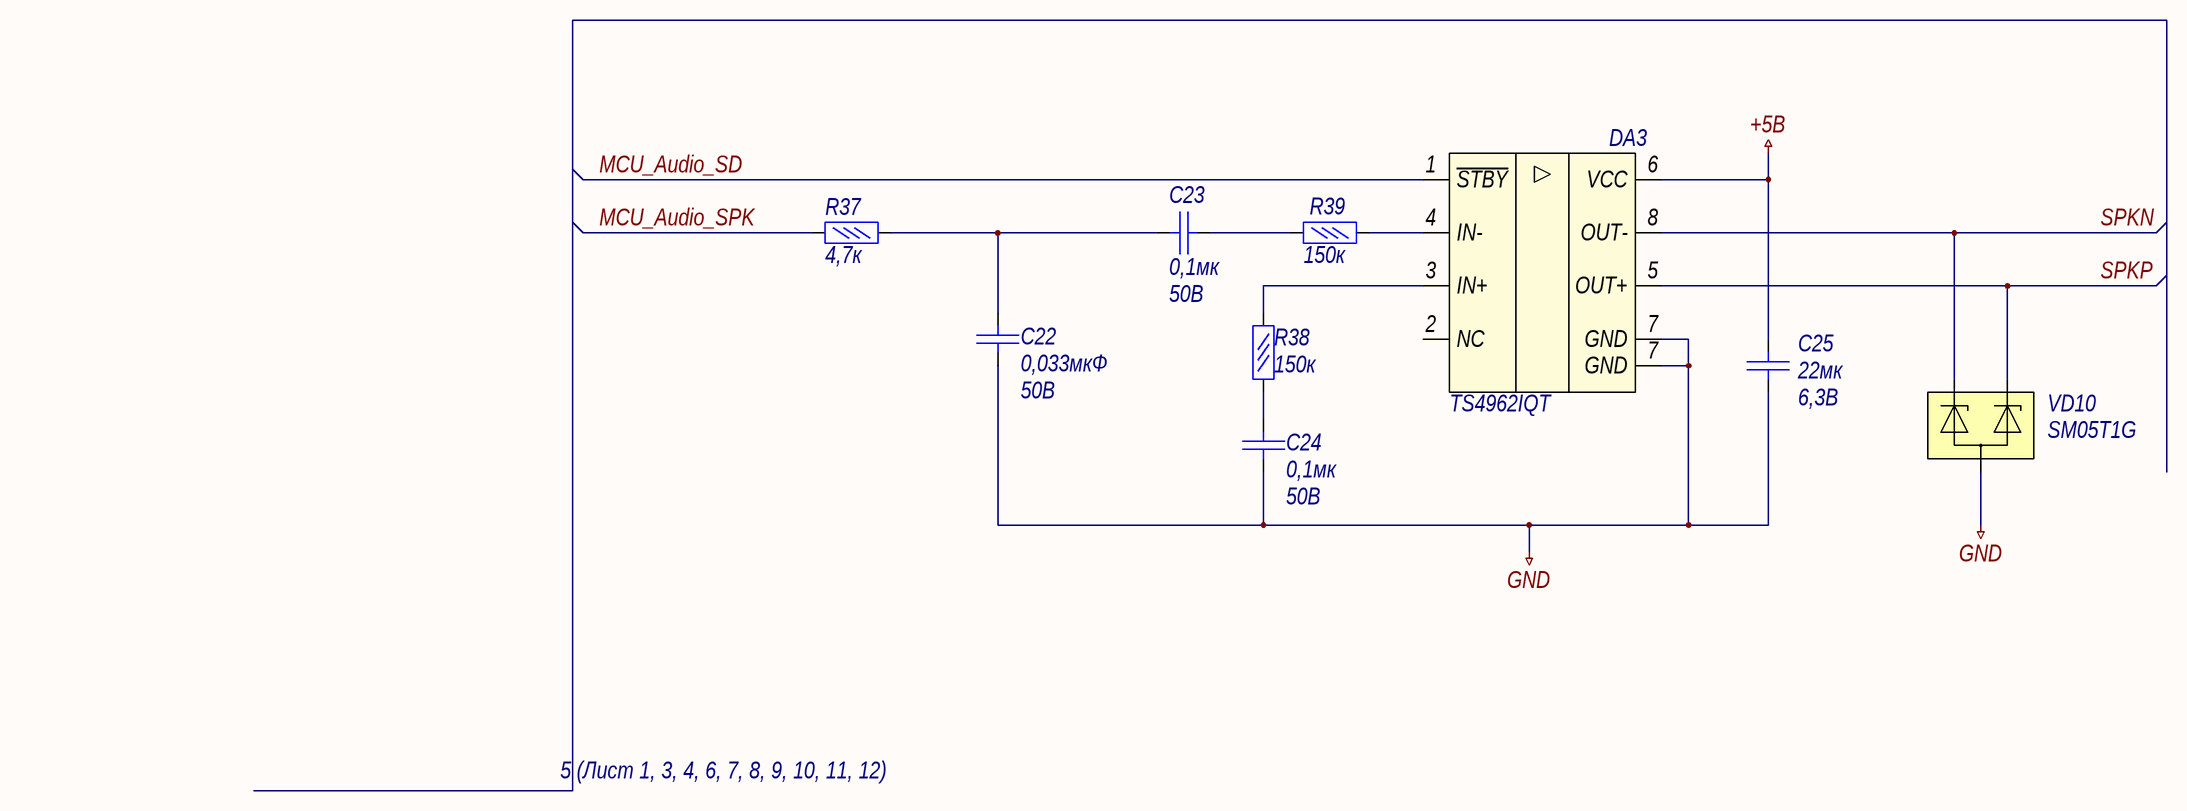
[diagram p4: РЕУН.468323.001_Audio.SchDoc]

### Parts
C22  Voltage: 50В  [C0805_AA]  (hidden comment: 0,033мкФ)
C23  Voltage: 50В  [C0805_AA]  (hidden comment: 0,1мк)
C24  Voltage: 50В  [C0805_AA]  (hidden comment: 0,1мк)
C25  Voltage: 6,3В  [C0805_AA]  (hidden comment: 22мк)
DA3  TS4962IQT
R37  4,7к  [R1206]
R38  150к  [R1206]
R39  150к  [R1206]
VD10  SM05T1G

### Nets
+5В: C25.2 DA3.6(VCC)
GND: C22.1 C24.1 C25.1 DA3.7(GND) VD10.3
MCU_Audio_SD: DA3.1(~{STBY})
MCU_Audio_SPK: R37.2
SPKN: DA3.8(OUT-) VD10.1
SPKP: DA3.5(OUT+) VD10.2
NetC22_2: C22.2 C23.2 R37.1
NetC23_1: C23.1 R39.2
NetC24_2: C24.2 R38.1
NetDA3_3: DA3.3(IN+) R38.2
NetDA3_4: DA3.4(IN-) R39.1

Not connected (* = marked no-connect by the designer): DA3 2(NC)

### Notes on the sheet
- 5 (Лист 1, 3, 4, 6, 7, 8, 9, 10, 11, 12)
- Подп. и дата
- Инв. № дубл.
- Взам. инв. №
- Инв. № подл.
- Лист
- Изм.
- № докум.
- Подп.
- Дата
- Копировал
- Формат

### Library data of the parts
C22-C25 = Конденсатор кер.
  C22: Value: 0,033мкФ
  C23 C24: Value: 0,1мк
  C25: Value: 22мк
DA3 = TS4962: Audio Power Amplifier
R37-R39 = Резистор  0,05Вт: Резистор 0,05Вт; Power rating: 0,05Вт
  R37: Value: 4,7к
  R38 R39: Value: 150к
VD10 = ZenerArray2: Сборка TVS-диодов; Parameter 1: *

## Sheet РЕУН.468323.001_LED_DRV_ISO_1.SchDoc: =Name-1str
size 594 x 420 mm; SheetNumber: 6; Вид изделия: Документация; Раздел: Документация; Код документа: Э3; Вид документа: Схема электрическая принципиальная; Класс документа: Конструкторский документ; Создавать изделие в PLM: Yes; DocumentCode: РЕУН.468323.001 Э3 2D; DocumentView: Схема электрическая принципиальная; DocumentClass: Конструкторский документ; ProductView: Документация; Format: А2
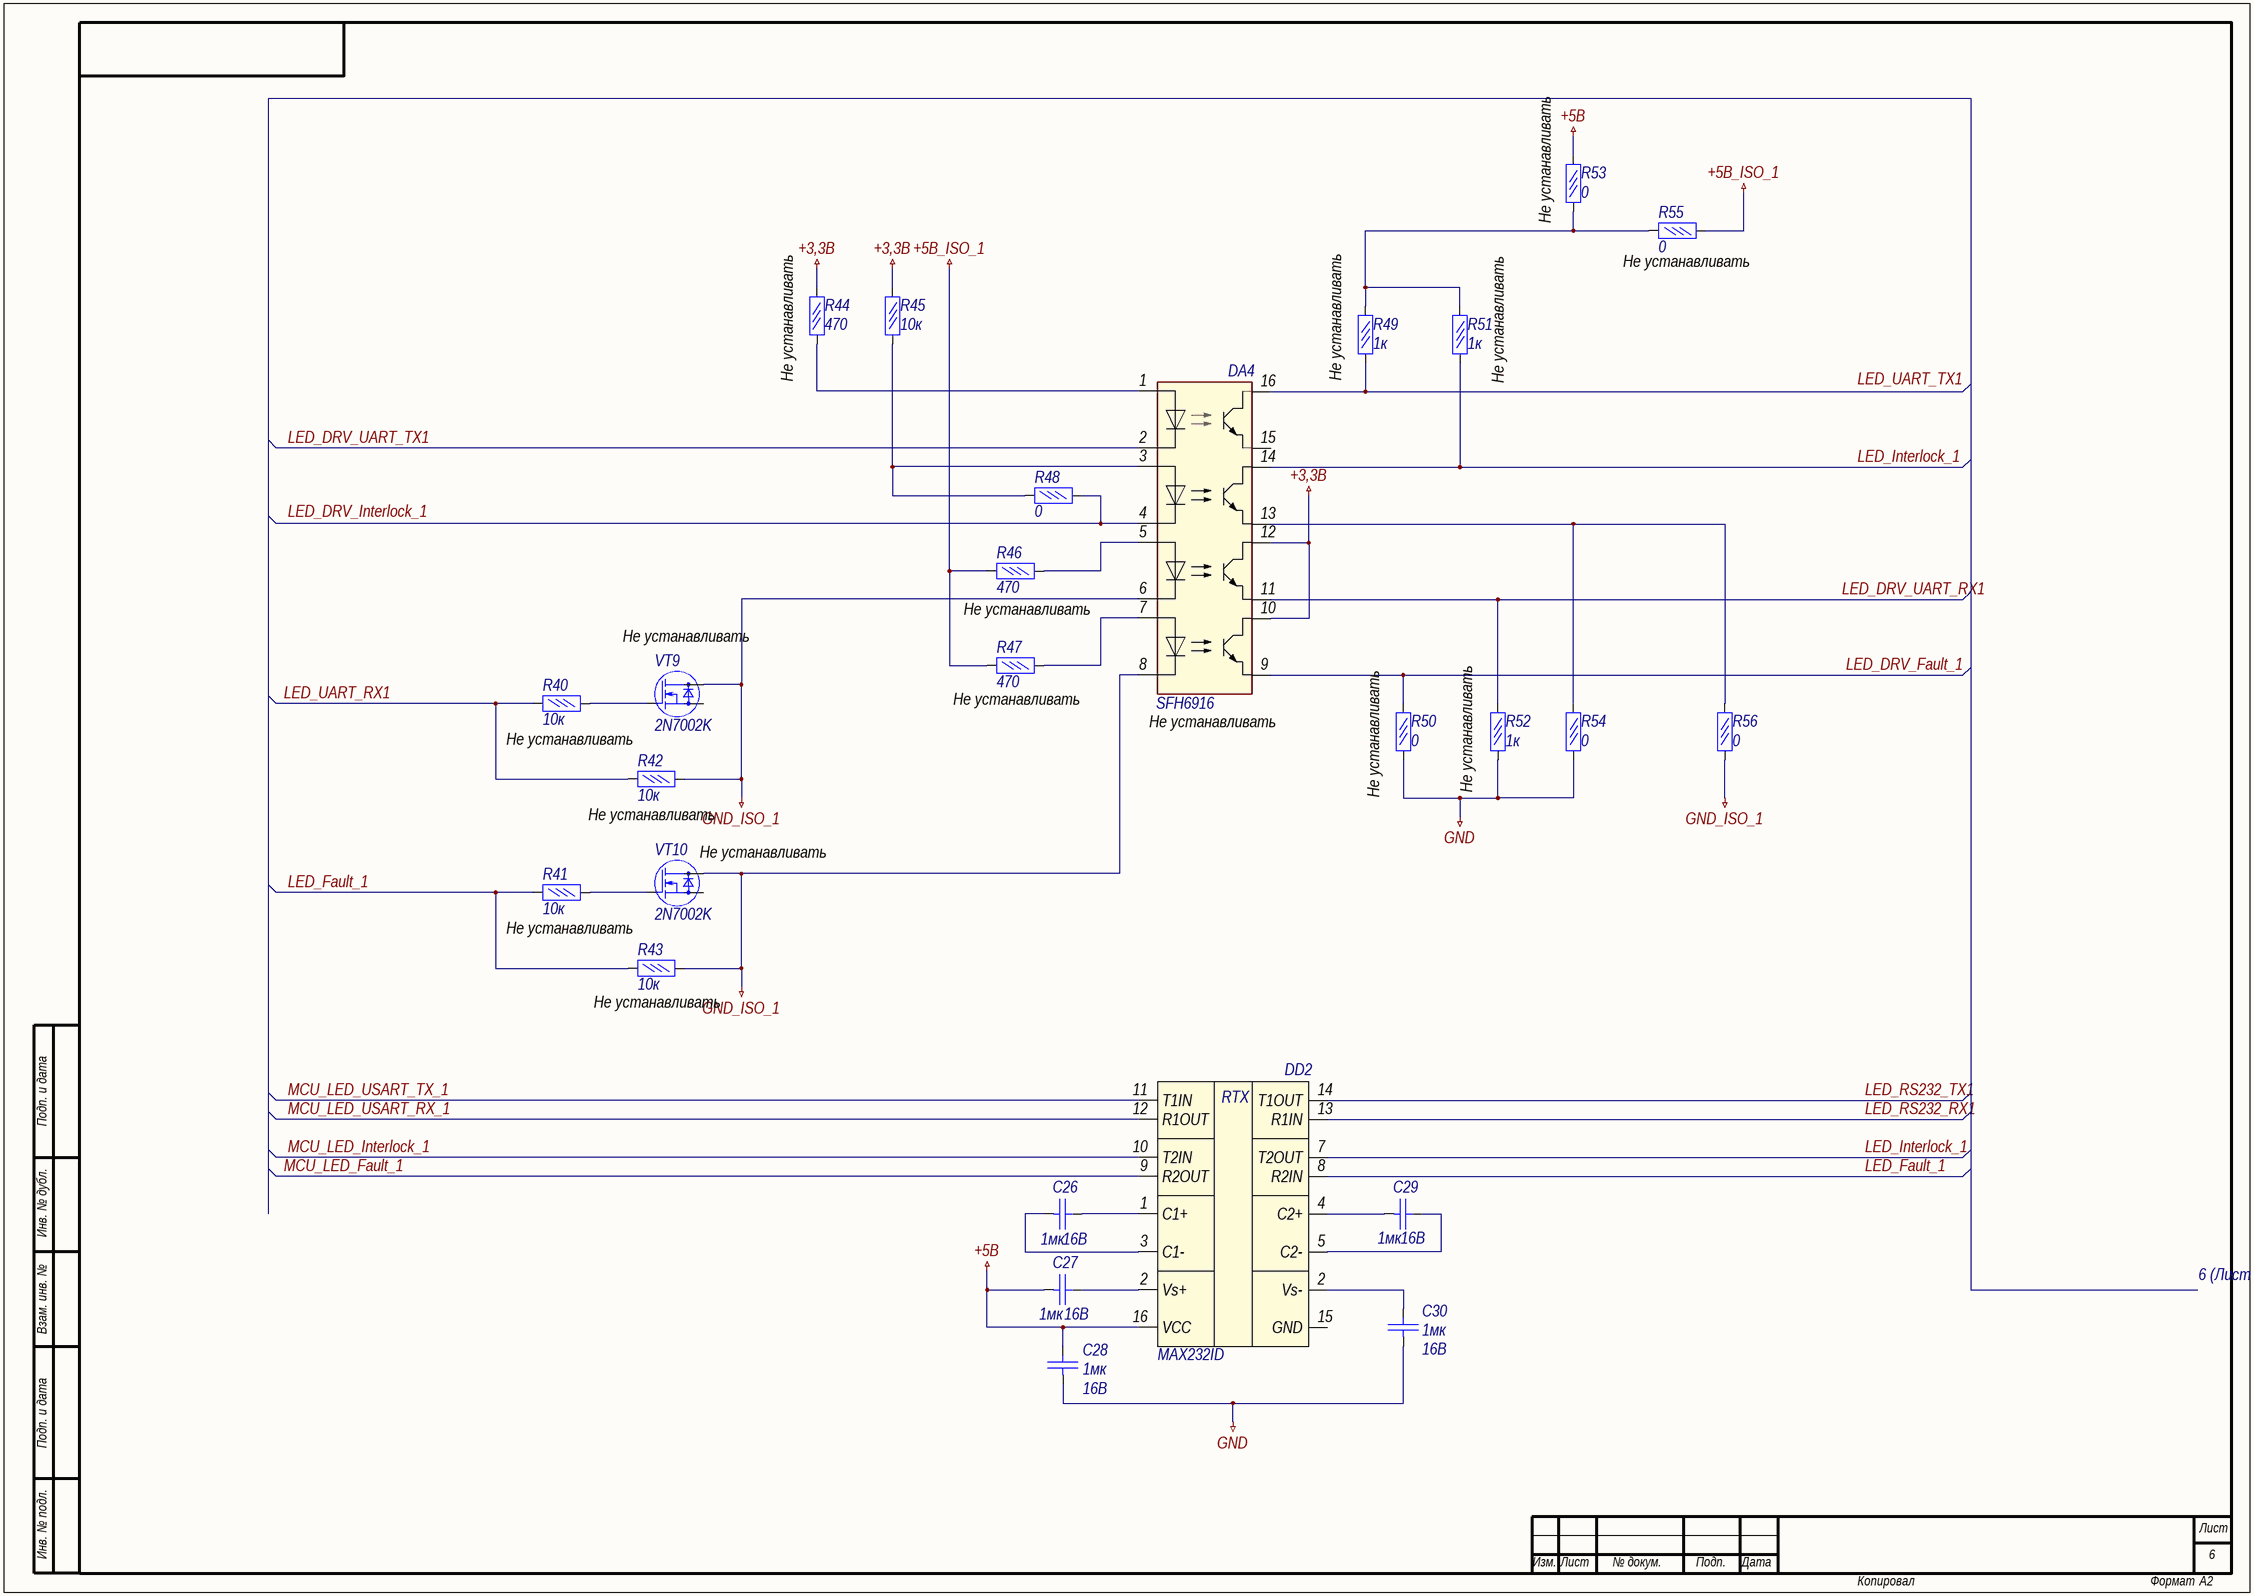
[diagram p5: РЕУН.468323.001_LED_DRV_ISO_1.SchDoc]

### Parts
C26  Voltage: 16В  [C0805_AA]  (hidden comment: 1мк)
C27  Voltage: 16В  [C0805_AA]  (hidden comment: 1мк)
C28  Voltage: 16В  [C0805_AA]  (hidden comment: 1мк)
C29  Voltage: 16В  [C0805_AA]  (hidden comment: 1мк)
C30  Voltage: 16В  [C0805_AA]  (hidden comment: 1мк)
DA4  SFH6916
DD2  MAX232ID
R40  10к  [R1206]
R41  10к  [R1206]
R42  10к  [R1206]
R43  10к  [R1206]
R44  470  [R1206]
R45  10к  [R1206]
R46  470  [R1206]
R47  470  [R1206]
R48  0  [R1206]
R49  1к  [R1206]
R50  0  [R1206]
R51  1к  [R1206]
R52  1к  [R1206]
R53  0  [R1206]
R54  0  [R1206]
R55  0  [R1206]
R56  0  [R1206]
VT9  2N7002K  [SOT23-3]
VT10  2N7002K  [SOT23-3]

### Nets
+3,3В: DA4.10 DA4.12 R44.1 R45.2
+5В: C27.2 C28.1 DD2.16(VCC) R53.1
+5В_ISO_1: R46.1 R47.1 R55.1
GND: C28.2 C30.2 R50.1 R52.1 R54.1
GND_ISO_1: DA4.6 DA4.8 R42.2 R43.2 R56.1 VT9.3(D) VT10.3(D)
LED_DRV_Fault_1: DA4.9 R50.2
LED_DRV_UART_RX1: DA4.11 R52.2
LED_DRV_UART_TX1: DA4.2
LED_Fault_1: DD2.8(R2IN) R41.1 R43.1
LED_Interlock_1: DA4.14 DD2.7(T2OUT) R51.1
LED_RS232_RX1: DD2.13(R1IN)
LED_RS232_TX1: DD2.14(T1OUT)
LED_UART_RX1: R40.1 R42.1
MCU_LED_Fault_1: DD2.9(R2OUT)
MCU_LED_Interlock_1: DD2.10(T2IN)
MCU_LED_USART_RX_1: DD2.12(R1OUT)
MCU_LED_USART_TX_1: DD2.11(T1IN)
NetC26_1: C26.1 DD2.1(C1+)
NetC26_2: C26.2 DD2.3(C1-)
NetC27_1: C27.1 DD2.2(Vs+)
NetC29_1: C29.1 DD2.5(C2-)
NetC29_2: C29.2 DD2.4(C2+)
NetC30_1: C30.1 DD2.2(Vs-)
NetDA4_1: DA4.1 R44.2
NetDA4_3: DA4.3 R45.1 R48.1
NetDA4_4: DA4.4 R48.2
NetDA4_5: DA4.5 R46.2
NetDA4_7: DA4.7 R47.2
NetDA4_13: DA4.13 R54.2 R56.2
NetDA4_16: DA4.16 R49.1
NetR40_2: R40.2 VT9.1(G)
NetR41_2: R41.2 VT10.1(G)
NetR49_2: R49.2 R51.2 R53.2 R55.2

Not connected (* = marked no-connect by the designer): DA4 15; DD2 15(GND); VT9 2(S); VT10 2(S)

### Notes on the sheet
- (near R53) Не устанавливать
- (near R55) Не устанавливать
- (near R44) Не устанавливать
- (near R49) Не устанавливать
- (near R51) Не устанавливать
- (near VT9) Не устанавливать
- Не устанавливать
- (near R47) Не устанавливать
- (near DA4) Не устанавливать
- (near R50) Не устанавливать
- (near R52) Не устанавливать
- (near R42) Не устанавливать
- (near VT10) Не устанавливать
- (near R43) Не устанавливать
- 6 (Лист 1, 3, 4, 5, 7, 8, 9, 10, 11, 12)
- Labels drawn without touching a wire or pin: LED_DRV_Interlock_1, LED_UART_TX1
- Подп. и дата
- Инв. № дубл.
- Взам. инв. №
- Инв. № подл.
- Лист
- Изм.
- № докум.
- Подп.
- Дата
- Копировал
- Формат
- (in symbol MAX232ID) RTX

### Library data of the parts
C26-C30 = Конденсатор кер.: Name: CC0603KRX7R7BB105; Value: 1мк
DA4 = OPTO-4: Опторазвязка х4
DD2 = MAX232ID: Dual EIA-232 Drivers/Receivers
R40-R56 = Резистор  0,05Вт: Резистор 0,05Вт; Power rating: 0,05Вт
  R40-R43 R45: Value: 10к
  R44 R46 R47: Value: 470
  R48 R50 R53-R56: Value: 0
  R49 R51 R52: Value: 1к
VT9 VT10 = mosfet-n: Name: 2N7002K

## Sheet РЕУН.468323.001_LED_DRV_ISO_2.SchDoc: =Name-1str
size 594 x 420 mm; SheetNumber: 7; Вид изделия: Документация; Раздел: Документация; Код документа: Э3; Вид документа: Схема электрическая принципиальная; Класс документа: Конструкторский документ; Создавать изделие в PLM: Yes; DocumentCode: РЕУН.468323.001 Э3 2D; DocumentView: Схема электрическая принципиальная; DocumentClass: Конструкторский документ; ProductView: Документация; Format: А2
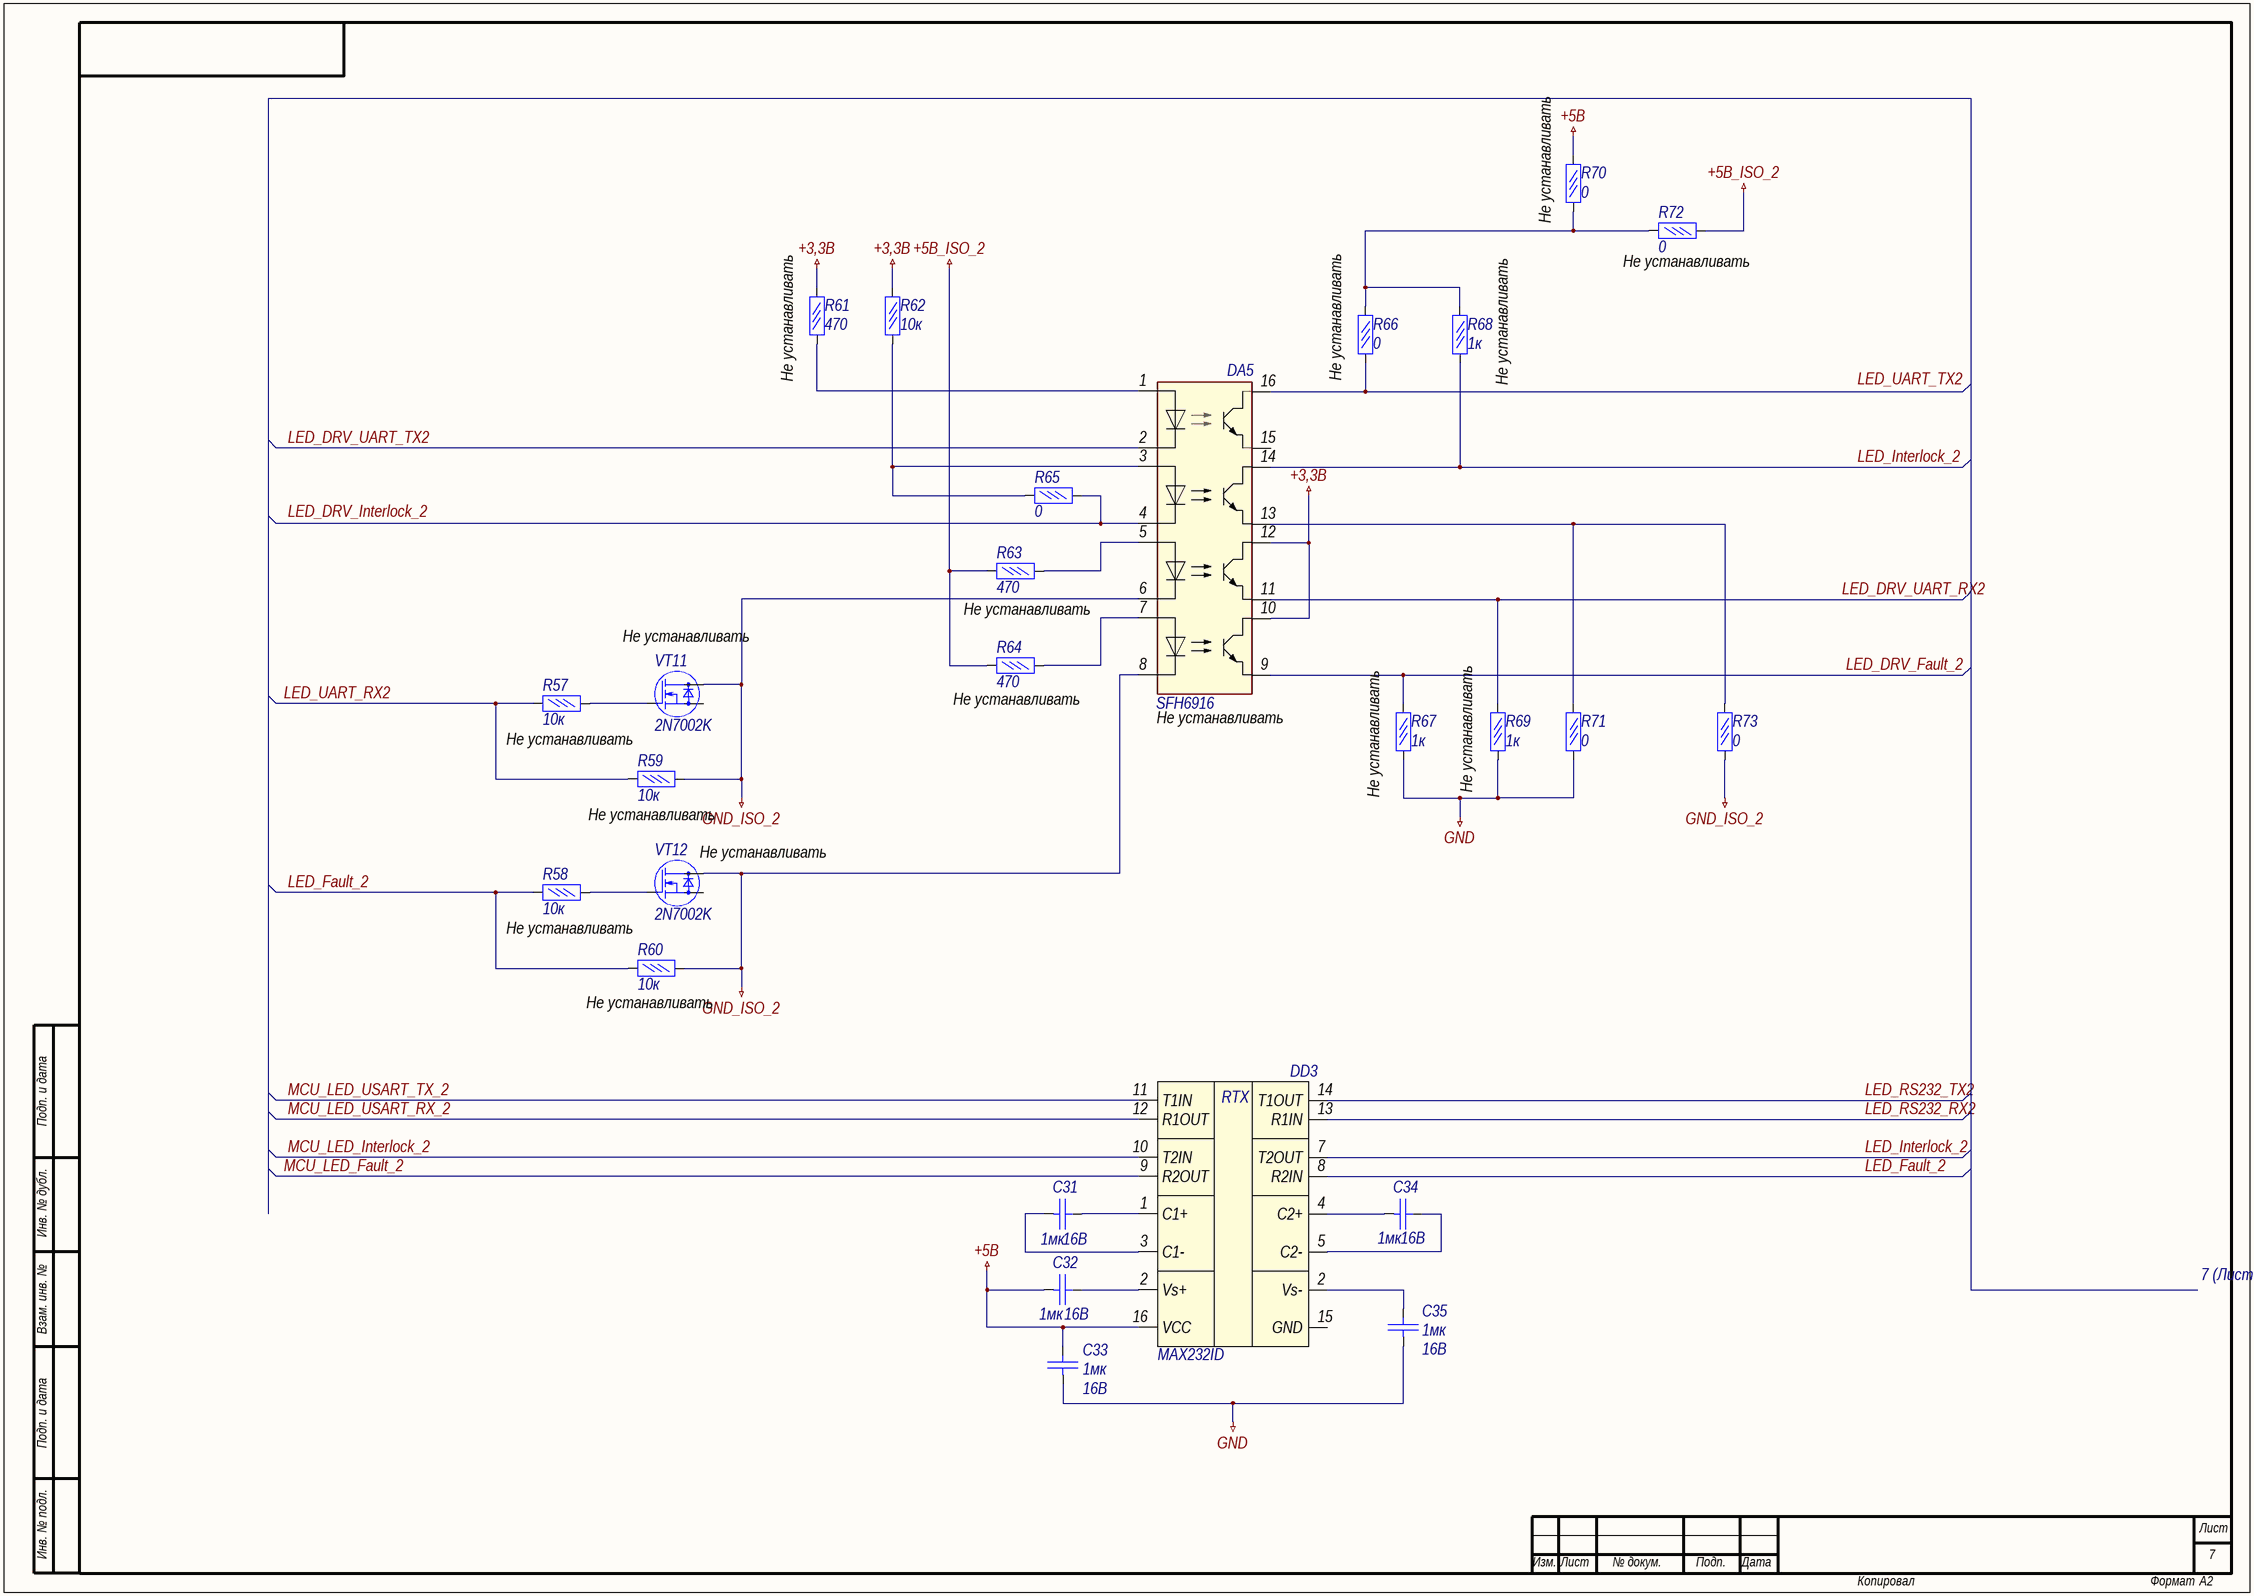
[diagram p6: РЕУН.468323.001_LED_DRV_ISO_2.SchDoc]

### Parts
C31  Voltage: 16В  [C0805_AA]  (hidden comment: 1мк)
C32  Voltage: 16В  [C0805_AA]  (hidden comment: 1мк)
C33  Voltage: 16В  [C0805_AA]  (hidden comment: 1мк)
C34  Voltage: 16В  [C0805_AA]  (hidden comment: 1мк)
C35  Voltage: 16В  [C0805_AA]  (hidden comment: 1мк)
DA5  SFH6916
DD3  MAX232ID
R57  10к  [R1206]
R58  10к  [R1206]
R59  10к  [R1206]
R60  10к  [R1206]
R61  470  [R1206]
R62  10к  [R1206]
R63  470  [R1206]
R64  470  [R1206]
R65  0  [R1206]
R66  0  [R1206]
R67  1к  [R1206]
R68  1к  [R1206]
R69  1к  [R1206]
R70  0  [R1206]
R71  0  [R1206]
R72  0  [R1206]
R73  0  [R1206]
VT11  2N7002K  [SOT23-3]
VT12  2N7002K  [SOT23-3]

### Nets
+3,3В: DA5.10 DA5.12 R61.1 R62.2
+5В: C32.2 C33.1 DD3.16(VCC) R70.1
+5В_ISO_2: R63.1 R64.1 R72.1
GND: C33.2 C35.2 R67.1 R69.1 R71.1
GND_ISO_2: DA5.6 DA5.8 R59.2 R60.2 R73.1 VT11.3(D) VT12.3(D)
LED_DRV_Fault_2: DA5.9 R67.2
LED_DRV_UART_RX2: DA5.11 R69.2
LED_DRV_UART_TX2: DA5.2
LED_Fault_2: DD3.8(R2IN) R58.1 R60.1
LED_Interlock_2: DA5.14 DD3.7(T2OUT) R68.1
LED_RS232_RX2: DD3.13(R1IN)
LED_RS232_TX2: DD3.14(T1OUT)
LED_UART_RX2: R57.1 R59.1
MCU_LED_Fault_2: DD3.9(R2OUT)
MCU_LED_Interlock_2: DD3.10(T2IN)
MCU_LED_USART_RX_2: DD3.12(R1OUT)
MCU_LED_USART_TX_2: DD3.11(T1IN)
NetC31_1: C31.1 DD3.1(C1+)
NetC31_2: C31.2 DD3.3(C1-)
NetC32_1: C32.1 DD3.2(Vs+)
NetC34_1: C34.1 DD3.5(C2-)
NetC34_2: C34.2 DD3.4(C2+)
NetC35_1: C35.1 DD3.2(Vs-)
NetDA5_1: DA5.1 R61.2
NetDA5_3: DA5.3 R62.1 R65.1
NetDA5_4: DA5.4 R65.2
NetDA5_5: DA5.5 R63.2
NetDA5_7: DA5.7 R64.2
NetDA5_13: DA5.13 R71.2 R73.2
NetDA5_16: DA5.16 R66.1
NetR57_2: R57.2 VT11.1(G)
NetR58_2: R58.2 VT12.1(G)
NetR66_2: R66.2 R68.2 R70.2 R72.2

Not connected (* = marked no-connect by the designer): DA5 15; DD3 15(GND); VT11 2(S); VT12 2(S)

### Notes on the sheet
- (near R70) Не устанавливать
- (near R72) Не устанавливать
- (near R61) Не устанавливать
- (near R66) Не устанавливать
- (near R68) Не устанавливать
- (near VT11) Не устанавливать
- Не устанавливать
- (near R64) Не устанавливать
- (near DA5) Не устанавливать
- (near R67) Не устанавливать
- (near R69) Не устанавливать
- (near R59) Не устанавливать
- (near VT12) Не устанавливать
- (near R60) Не устанавливать
- 7 (Лист 1, 3, 4, 5, 6, 8, 9, 10, 11, 12)
- Labels drawn without touching a wire or pin: LED_DRV_Interlock_2, LED_UART_TX2
- Подп. и дата
- Инв. № дубл.
- Взам. инв. №
- Инв. № подл.
- Лист
- Изм.
- № докум.
- Подп.
- Дата
- Копировал
- Формат
- (in symbol MAX232ID) RTX

### Library data of the parts
C31-C35 = Конденсатор кер.: Name: CC0603KRX7R7BB105; Value: 1мк
DA5 = OPTO-4: Опторазвязка х4
DD3 = MAX232ID: Dual EIA-232 Drivers/Receivers
R57-R73 = Резистор  0,05Вт: Резистор 0,05Вт; Power rating: 0,05Вт
  R57-R60 R62: Value: 10к
  R61 R63 R64: Value: 470
  R65 R66 R70-R73: Value: 0
  R67-R69: Value: 1к
VT11 VT12 = mosfet-n: Name: 2N7002K

## Sheet РЕУН.468323.001_LED_DRV_TEC.SchDoc: =Name-1str
size 594 x 420 mm; SheetNumber: 8; Вид изделия: Документация; Раздел: Документация; Код документа: Э3; Вид документа: Схема электрическая принципиальная; Класс документа: Конструкторский документ; Создавать изделие в PLM: Yes; DocumentCode: РЕУН.468323.001 Э3 2D; DocumentView: Схема электрическая принципиальная; DocumentClass: Конструкторский документ; ProductView: Документация; Format: А2
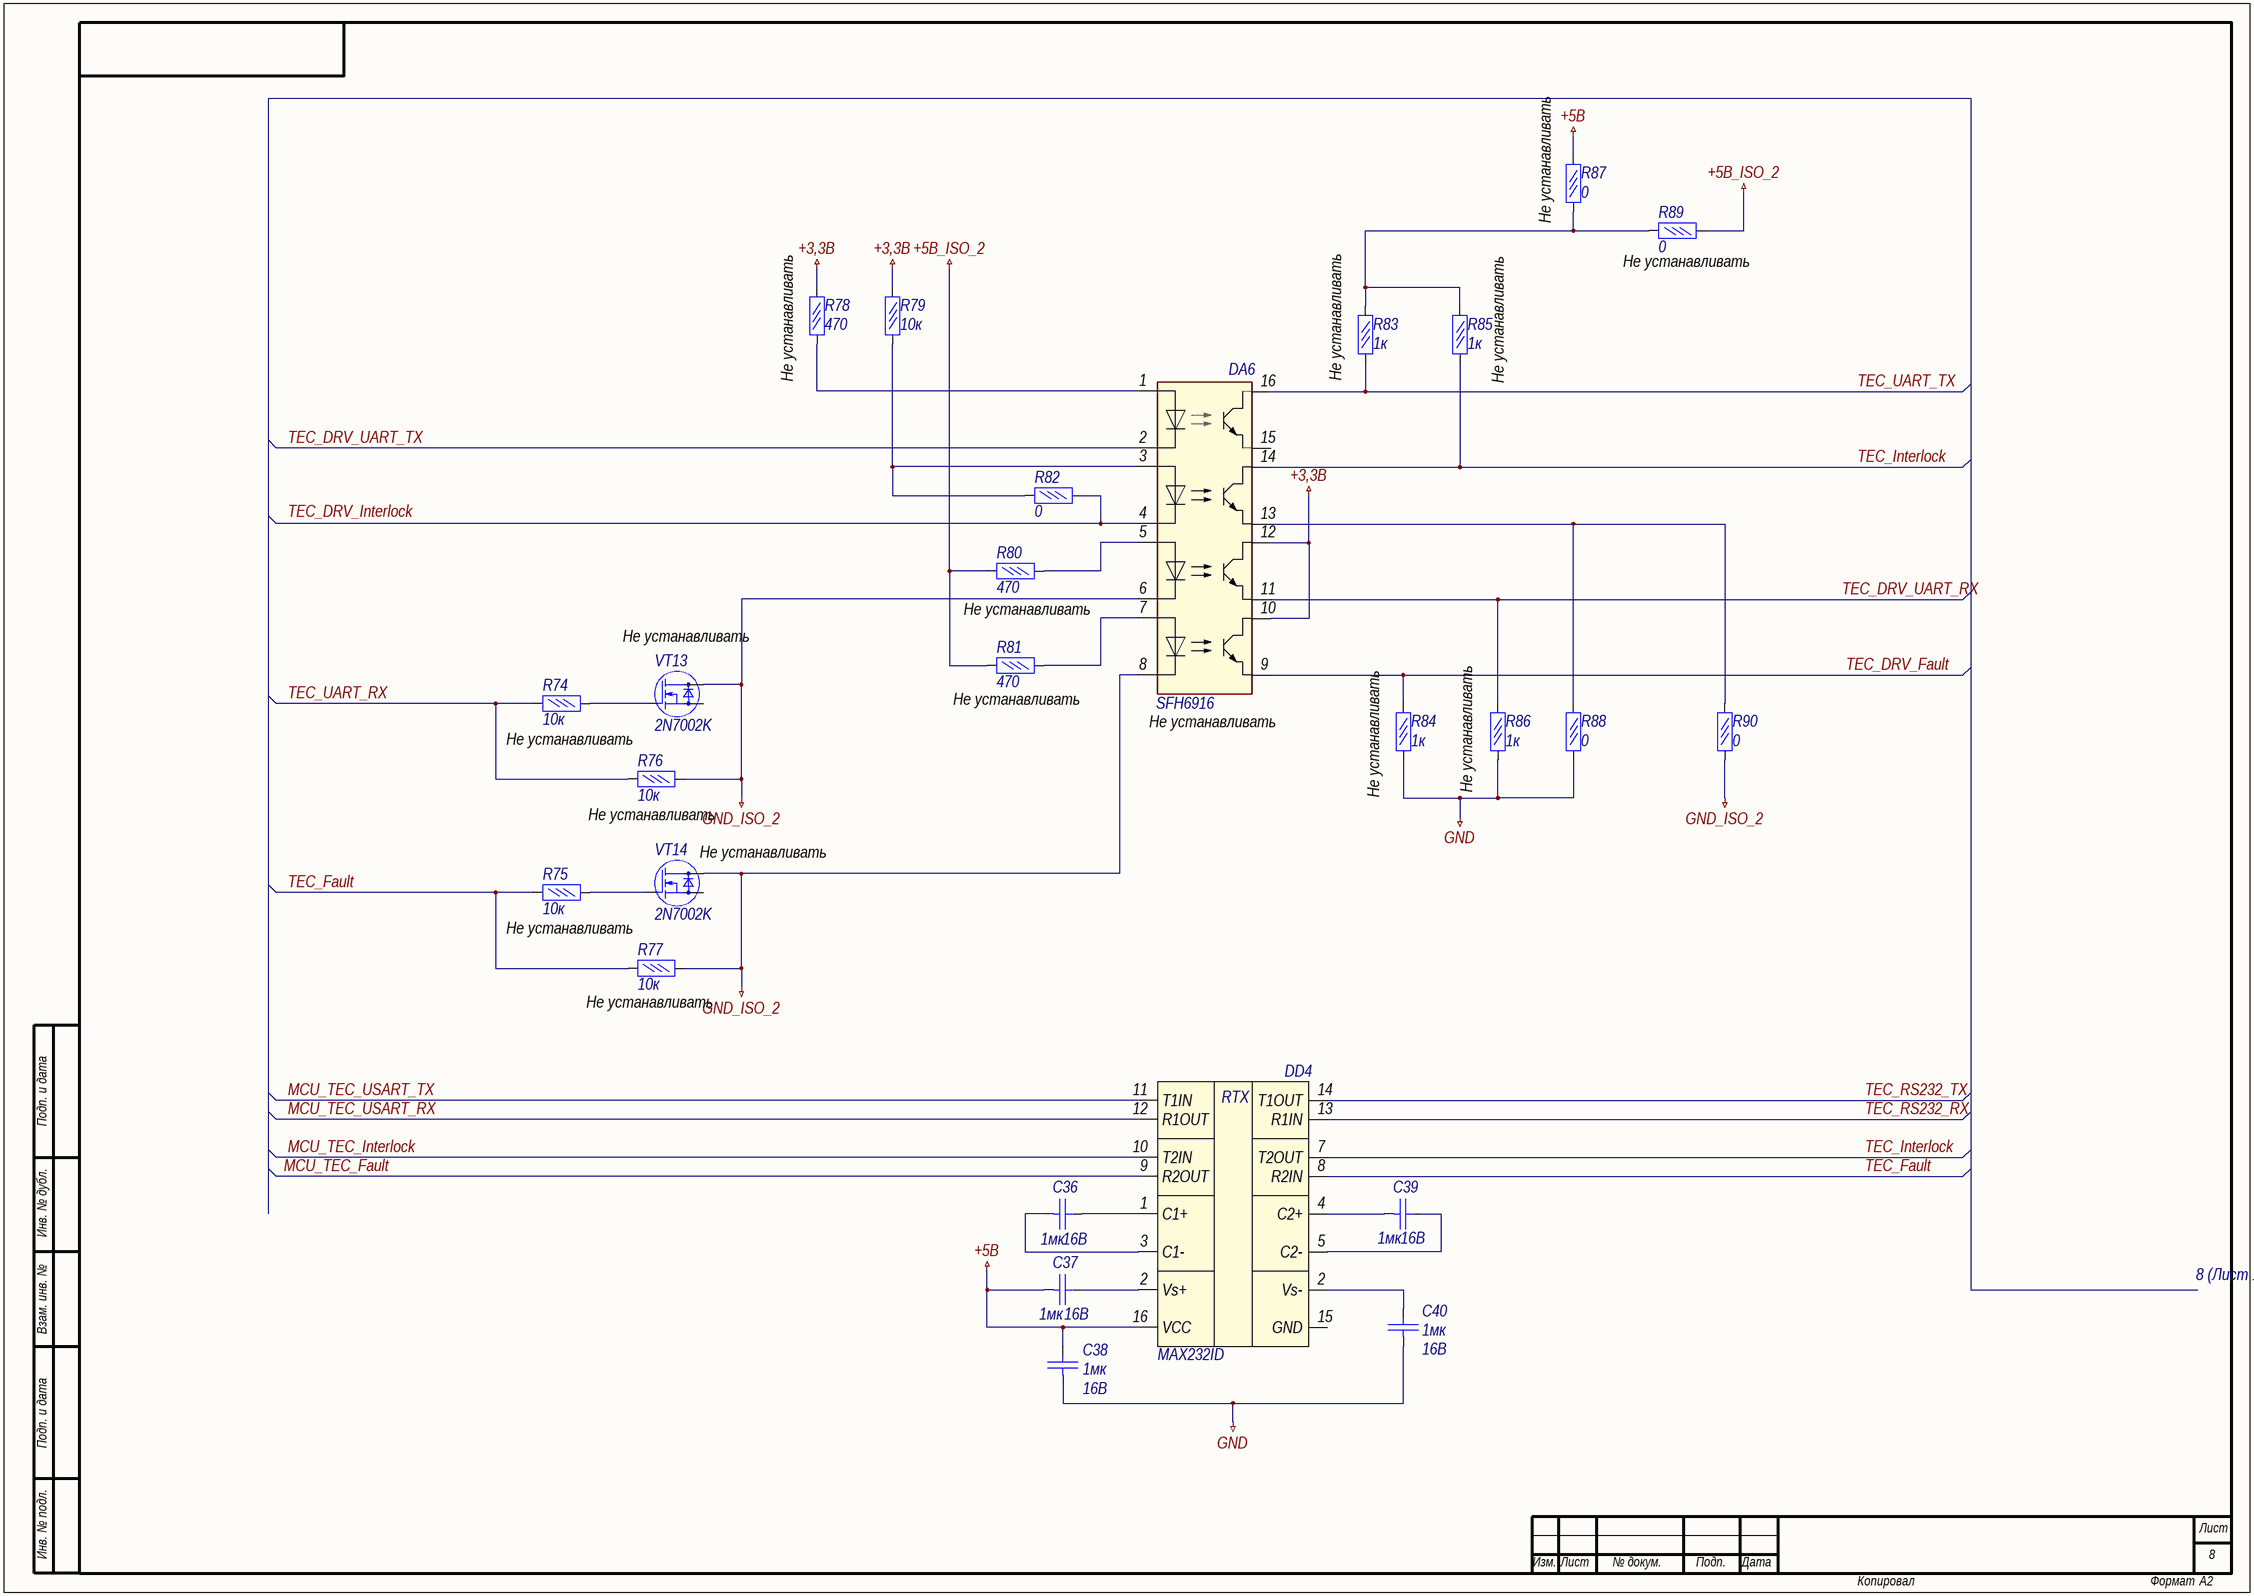
[diagram p7: РЕУН.468323.001_LED_DRV_TEC.SchDoc]

### Parts
C36  Voltage: 16В  [C0805_AA]  (hidden comment: 1мк)
C37  Voltage: 16В  [C0805_AA]  (hidden comment: 1мк)
C38  Voltage: 16В  [C0805_AA]  (hidden comment: 1мк)
C39  Voltage: 16В  [C0805_AA]  (hidden comment: 1мк)
C40  Voltage: 16В  [C0805_AA]  (hidden comment: 1мк)
DA6  SFH6916
DD4  MAX232ID
R74  10к  [R1206]
R75  10к  [R1206]
R76  10к  [R1206]
R77  10к  [R1206]
R78  470  [R1206]
R79  10к  [R1206]
R80  470  [R1206]
R81  470  [R1206]
R82  0  [R1206]
R83  1к  [R1206]
R84  1к  [R1206]
R85  1к  [R1206]
R86  1к  [R1206]
R87  0  [R1206]
R88  0  [R1206]
R89  0  [R1206]
R90  0  [R1206]
VT13  2N7002K  [SOT23-3]
VT14  2N7002K  [SOT23-3]

### Nets
+3,3В: DA6.10 DA6.12 R78.1 R79.2
+5В: C37.2 C38.1 DD4.16(VCC) R87.1
+5В_ISO_2: R80.1 R81.1 R89.1
GND: C38.2 C40.2 R84.1 R86.1 R88.1
GND_ISO_2: DA6.6 DA6.8 R76.2 R77.2 R90.1 VT13.3(D) VT14.3(D)
MCU_TEC_Fault: DD4.9(R2OUT)
MCU_TEC_Interlock: DD4.10(T2IN)
MCU_TEC_USART_RX: DD4.12(R1OUT)
MCU_TEC_USART_TX: DD4.11(T1IN)
TEC_DRV_Fault: DA6.9 R84.2
TEC_DRV_UART_RX: DA6.11 R86.2
TEC_DRV_UART_TX: DA6.2
TEC_Fault: DD4.8(R2IN) R75.1 R77.1
TEC_Interlock: DA6.14 DD4.7(T2OUT) R85.1
TEC_RS232_RX: DD4.13(R1IN)
TEC_RS232_TX: DD4.14(T1OUT)
TEC_UART_RX: R74.1 R76.1
TEC_UART_TX: DA6.16 R83.1
NetC36_1: C36.1 DD4.1(C1+)
NetC36_2: C36.2 DD4.3(C1-)
NetC37_1: C37.1 DD4.2(Vs+)
NetC39_1: C39.1 DD4.5(C2-)
NetC39_2: C39.2 DD4.4(C2+)
NetC40_1: C40.1 DD4.2(Vs-)
NetDA6_1: DA6.1 R78.2
NetDA6_3: DA6.3 R79.1 R82.1
NetDA6_4: DA6.4 R82.2
NetDA6_5: DA6.5 R80.2
NetDA6_7: DA6.7 R81.2
NetDA6_13: DA6.13 R88.2 R90.2
NetR74_2: R74.2 VT13.1(G)
NetR75_2: R75.2 VT14.1(G)
NetR83_2: R83.2 R85.2 R87.2 R89.2

Not connected (* = marked no-connect by the designer): DA6 15; DD4 15(GND); VT13 2(S); VT14 2(S)

### Notes on the sheet
- (near R87) Не устанавливать
- (near R89) Не устанавливать
- (near R78) Не устанавливать
- (near R83) Не устанавливать
- (near R85) Не устанавливать
- (near VT13) Не устанавливать
- Не устанавливать
- (near R81) Не устанавливать
- (near DA6) Не устанавливать
- (near R84) Не устанавливать
- (near R86) Не устанавливать
- (near R76) Не устанавливать
- (near VT14) Не устанавливать
- (near R77) Не устанавливать
- 8 (Лист 1, 3, 4, 5, 6, 7, 9, 10, 11, 12)
- Labels drawn without touching a wire or pin: TEC_DRV_Interlock
- Подп. и дата
- Инв. № дубл.
- Взам. инв. №
- Инв. № подл.
- Лист
- Изм.
- № докум.
- Подп.
- Дата
- Копировал
- Формат
- (in symbol MAX232ID) RTX

### Library data of the parts
C36-C40 = Конденсатор кер.: Name: CC0603KRX7R7BB105; Value: 1мк
DA6 = OPTO-4: Опторазвязка х4
DD4 = MAX232ID: Dual EIA-232 Drivers/Receivers
R74-R90 = Резистор  0,05Вт: Резистор 0,05Вт; Power rating: 0,05Вт
  R74-R77 R79: Value: 10к
  R78 R80 R81: Value: 470
  R82 R87-R90: Value: 0
  R83-R86: Value: 1к
VT13 VT14 = mosfet-n: Name: 2N7002K

## Sheet РЕУН.468323.001_USB-UART.SchDoc: =Name-1str
size 420 x 297 mm; SheetNumber: 9; Вид изделия: Документация; Раздел: Документация; Код документа: Э3; Вид документа: Схема электрическая принципиальная; Класс документа: Конструкторский документ; Создавать изделие в PLM: Yes; DocumentCode: РЕУН.468323.001 Э3 2D; DocumentView: Схема электрическая принципиальная; DocumentClass: Конструкторский документ; ProductView: Документация; Format: А3
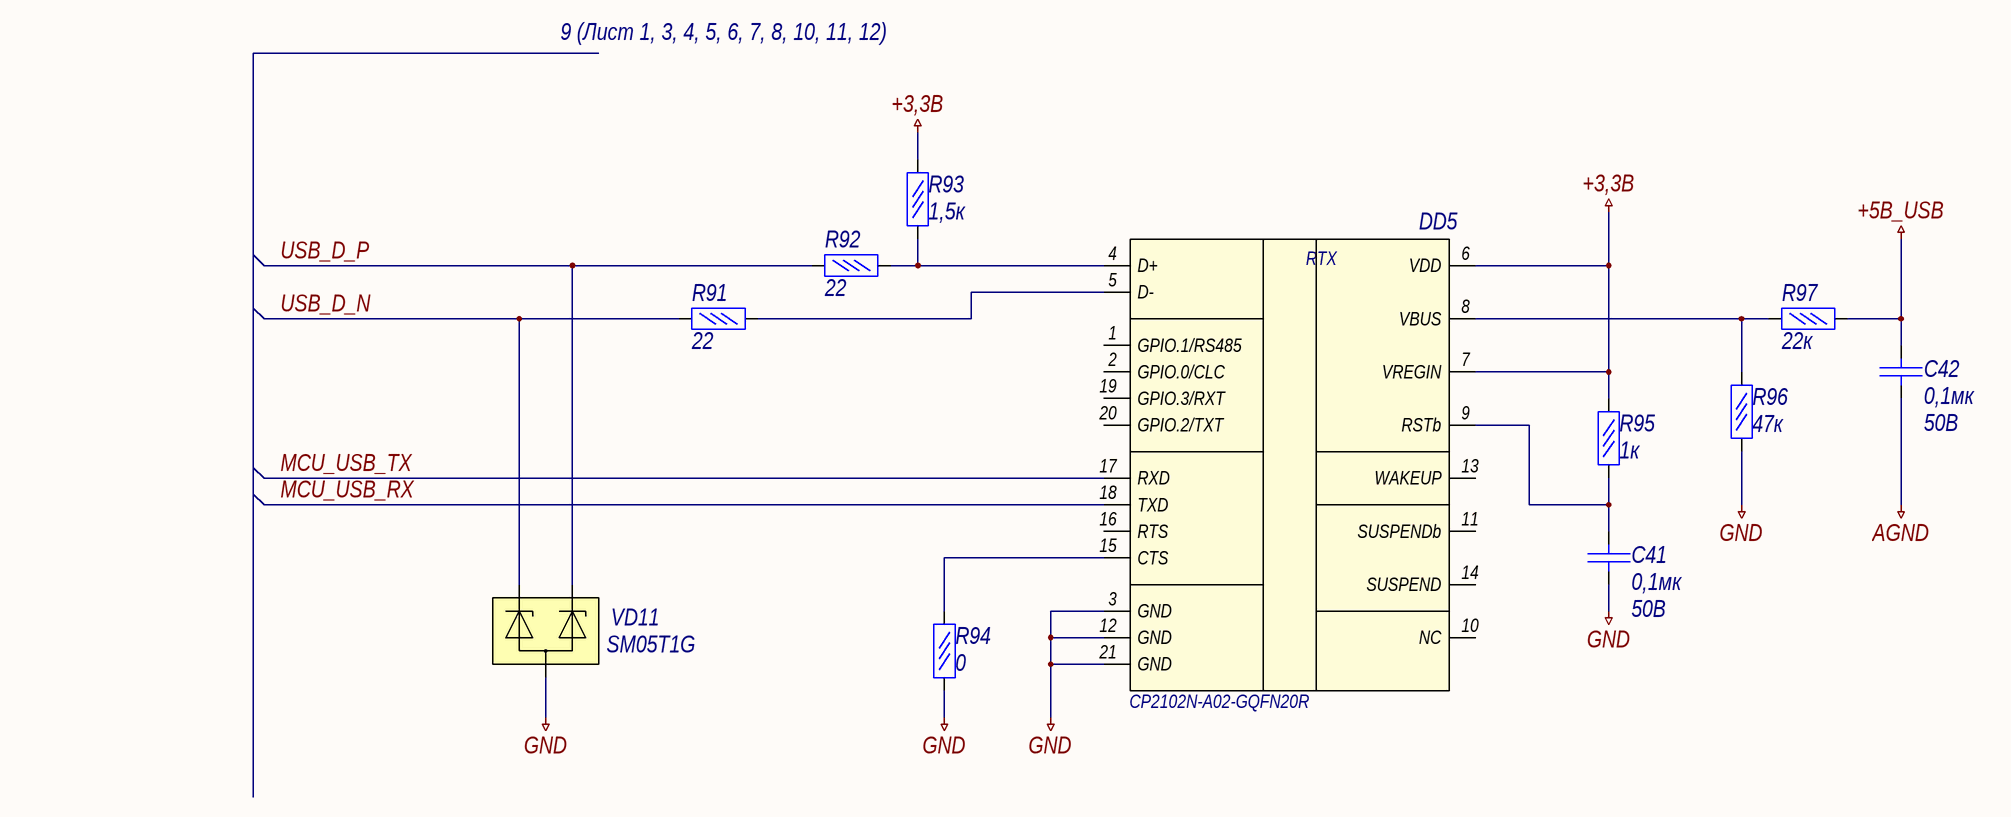
[diagram p8: РЕУН.468323.001_USB-UART.SchDoc]

### Parts
C41  Voltage: 50В  [C0805_AA]  (hidden comment: 0,1мк)
C42  Voltage: 50В  [C0805_AA]  (hidden comment: 0,1мк)
DD5  CP2102N-A02-GQFN20R
R91  22  [R1206]
R92  22  [R1206]
R93  5: 1,5к  [R1206]
R94  0  [R1206]
R95  1к  [R1206]
R96  47к  [R1206]
R97  22к  [R1206]
VD11  SM05T1G

### Nets
+3,3В: DD5.6(VDD) DD5.7(VREGIN) R93.2 R95.2
+5В_USB: C42.2 R97.2
AGND: C42.1
GND: C41.1 DD5.3(GND) DD5.12(GND) DD5.21(GND) R94.1 R96.1 VD11.3
MCU_USB_RX: DD5.18(TXD)
MCU_USB_TX: DD5.17(RXD)
USB_D_N: R91.1 VD11.1
USB_D_P: R92.1 VD11.2
NetC41_2: C41.2 DD5.9(RSTb) R95.1
NetDD5_4: DD5.4(D+) R92.2 R93.1
NetDD5_5: DD5.5(D-) R91.2
NetDD5_8: DD5.8(VBUS) R96.2 R97.1
NetDD5_15: DD5.15(CTS) R94.2

Not connected (* = marked no-connect by the designer): DD5 1(GPIO.1/RS485) 2(GPIO.0/CLC) 10(NC) 11(SUSPENDb) 13(WAKEUP) 14(SUSPEND) 16(RTS) 19(GPIO.3/RXT) 20(GPIO.2/TXT)

### Notes on the sheet
- 9 (Лист 1, 3, 4, 5, 6, 7, 8, 10, 11, 12)
- Подп. и дата
- Инв. № дубл.
- Взам. инв. №
- Инв. № подл.
- Лист
- Изм.
- № докум.
- Подп.
- Дата
- Копировал
- Формат
- (in symbol CP2102N-A02-GQFN20R) RTX

### Library data of the parts
C41 C42 = Конденсатор кер.: Value: 0,1мк
DD5 = CP2102N-A02-GQFN20R: USB-UART преобразователь
R91-R97 = Резистор  0,05Вт: Резистор 0,05Вт; Power rating: 0,05Вт
  R91 R92: Value: 22
  R94: Value: 0
  R95: Value: 1к
  R96: Value: 47к
  R97: Value: 22к
VD11 = ZenerArray2: Сборка TVS-диодов

## Sheet РЕУН.468323.001_EEPROM.SchDoc: =Name-1str
size 420 x 297 mm; SheetNumber: 10; Вид изделия: Документация; Раздел: Документация; Код документа: Э3; Вид документа: Схема электрическая принципиальная; Класс документа: Конструкторский документ; Создавать изделие в PLM: Yes; DocumentCode: РЕУН.468323.001 Э3 2D; DocumentView: Схема электрическая принципиальная; DocumentClass: Конструкторский документ; ProductView: Документация; Format: А3
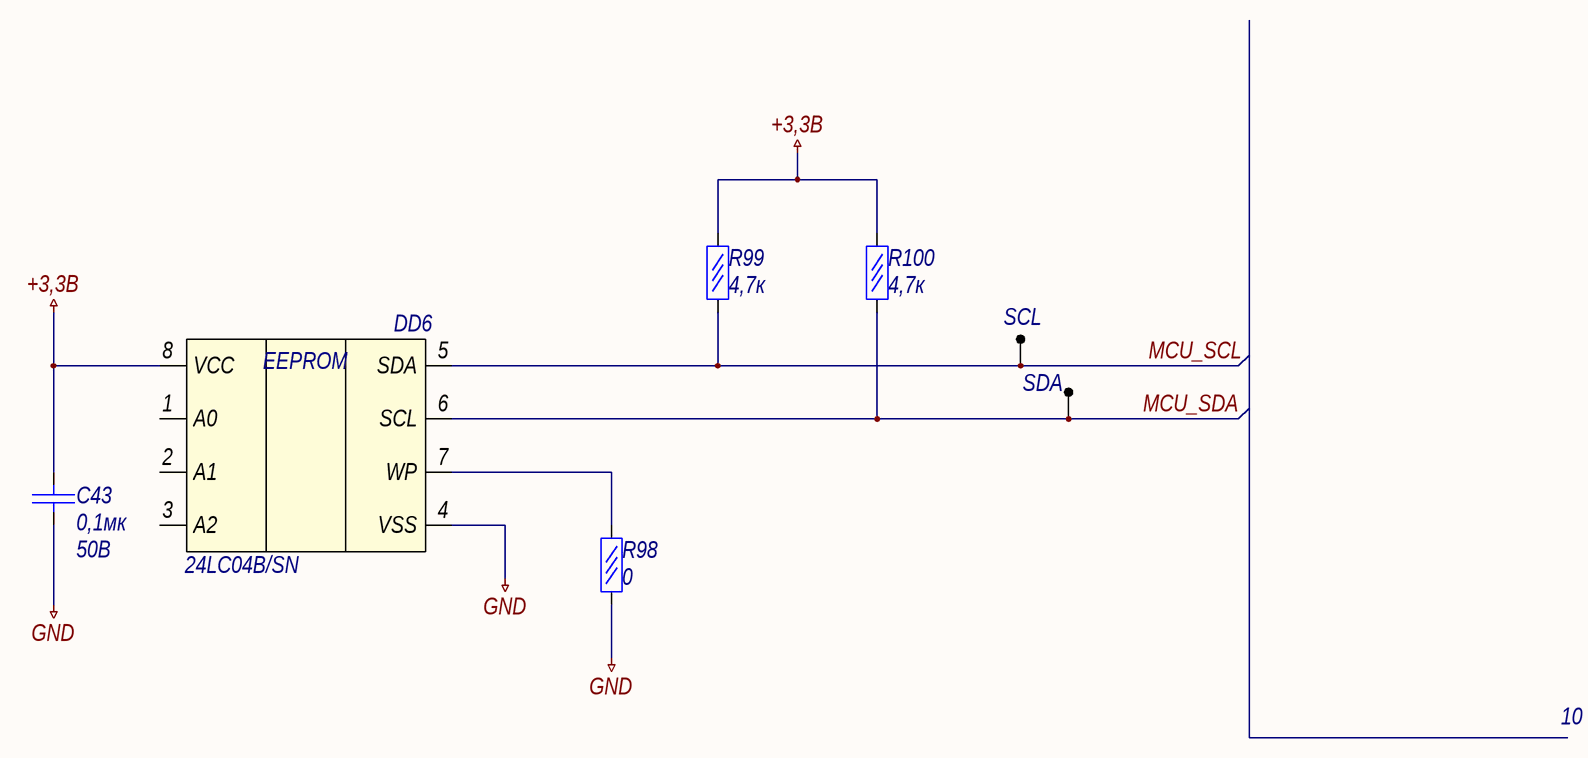
[diagram p9: РЕУН.468323.001_EEPROM.SchDoc]

### Parts
C43  Voltage: 50В  [C0805_AA]  (hidden comment: 0,1мк)
DD6  24LC04B/SN
R98  0  [R1206]
R99  4,7к  [R1206]
R100  4,7к  [R1206]
SCL  "1"  [0.5 x 1_round]  (value not drawn)
SDA  "1"  [0.5 x 1_round]  (value not drawn)

### Nets
+3,3В: C43.2 DD6.8(VCC) R99.2 R100.2
GND: C43.1 DD6.4(VSS) R98.1
MCU_SCL: DD6.5(SDA) R99.1 SCL.1
MCU_SDA: DD6.6(SCL) R100.1 SDA.1
NetDD6_7: DD6.7(WP) R98.2

Not connected (* = marked no-connect by the designer): DD6 1(A0) 2(A1) 3(A2)

### Notes on the sheet
- 10 (Лист 1, 3, 4, 5, 6, 7, 8, 9, 11, 12)
- Подп. и дата
- Инв. № дубл.
- Взам. инв. №
- Инв. № подл.
- Лист
- Изм.
- № докум.
- Подп.
- Дата
- Копировал
- Формат
- (in symbol 24LC04B) EEPROM

### Library data of the parts
C43 = Конденсатор кер.: Value: 0,1мк
DD6 = 24LC04B: 4K I2C Serial EEPROM
R98-R100 = Резистор  0,05Вт: Резистор 0,05Вт; Power rating: 0,05Вт
  R98: Value: 0
  R99 R100: Value: 4,7к
SCL SDA = TestPoint: Test point; Comment_1: "1"

## Sheet РЕУН.468323.001_INT.SchDoc: =Name-1str
size 420 x 297 mm; SheetNumber: 11; Вид изделия: Документация; Раздел: Документация; Код документа: Э3; Вид документа: Схема электрическая принципиальная; Класс документа: Конструкторский документ; Создавать изделие в PLM: Yes; DocumentCode: РЕУН.468323.001 Э3 2D; DocumentView: Схема электрическая принципиальная; DocumentClass: Конструкторский документ; ProductView: Документация; Format: А3
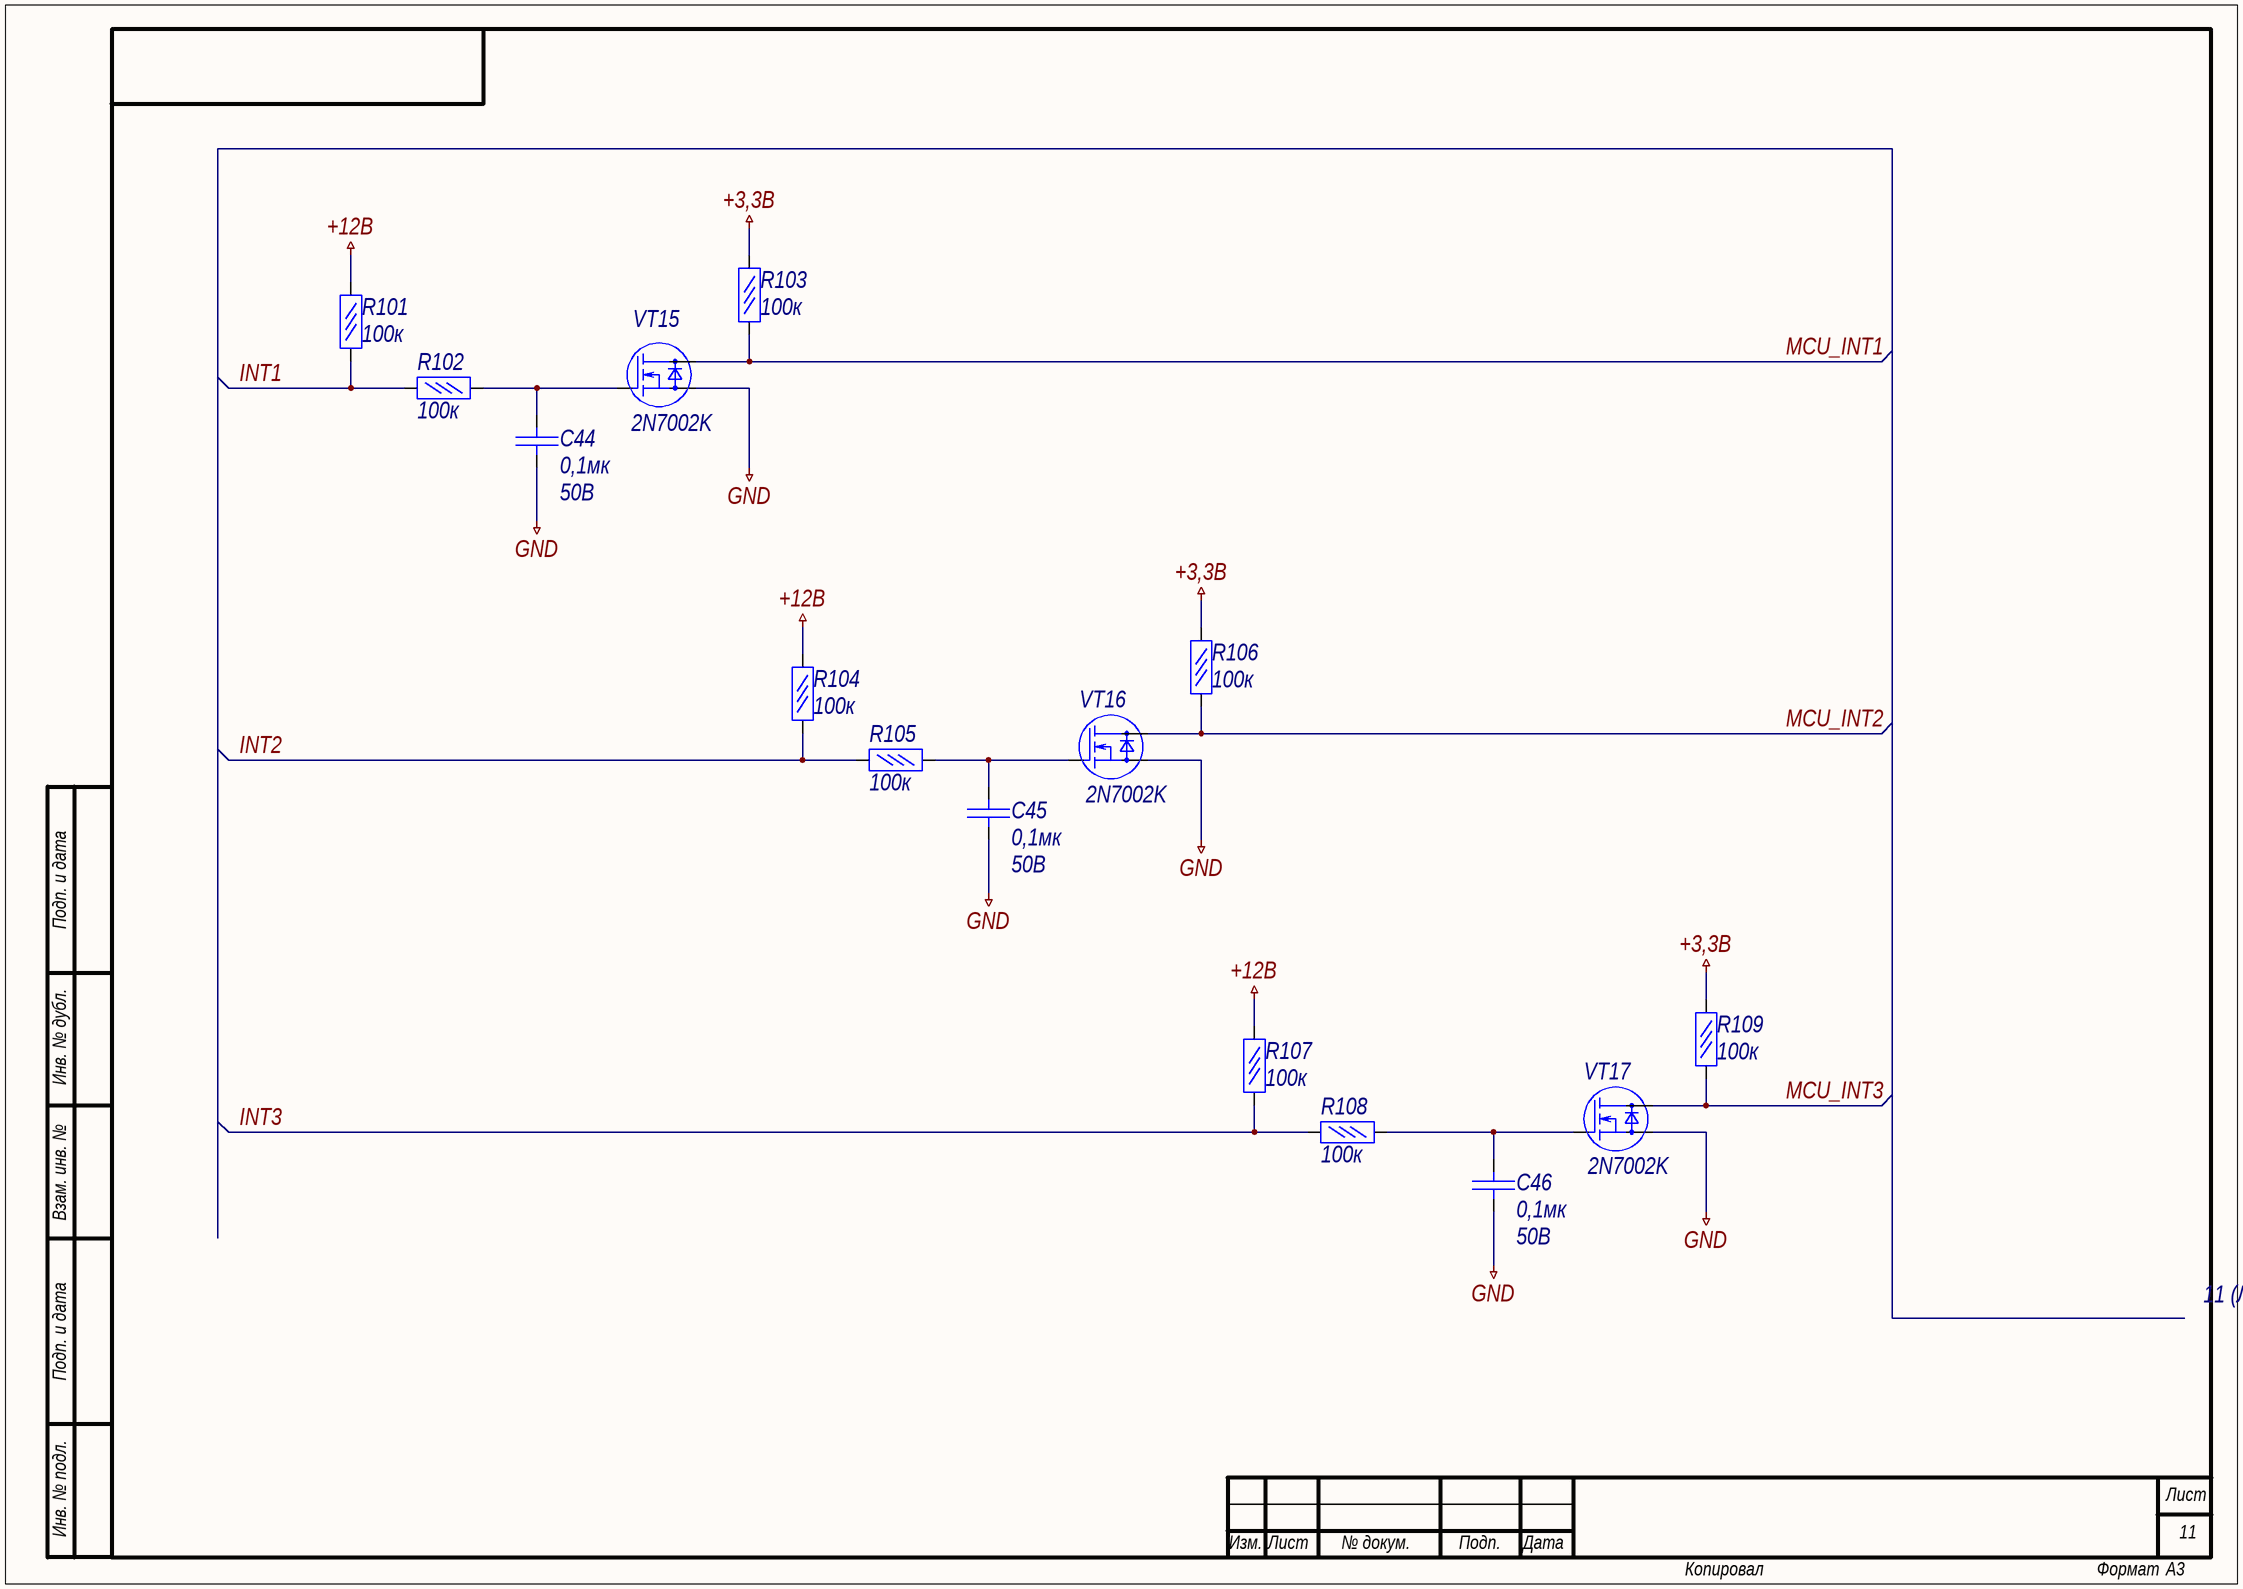
[diagram p10: РЕУН.468323.001_INT.SchDoc]

### Parts
C44  Voltage: 50В  [C0805_AA]  (hidden comment: 0,1мк)
C45  Voltage: 50В  [C0805_AA]  (hidden comment: 0,1мк)
C46  Voltage: 50В  [C0805_AA]  (hidden comment: 0,1мк)
R101  100к  [R1206]
R102  100к  [R1206]
R103  100к  [R1206]
R104  100к  [R1206]
R105  100к  [R1206]
R106  100к  [R1206]
R107  100к  [R1206]
R108  100к  [R1206]
R109  100к  [R1206]
VT15  2N7002K  [SOT23-3]
VT16  2N7002K  [SOT23-3]
VT17  2N7002K  [SOT23-3]

### Nets
+3,3В: R103.2 R106.2 R109.2
+12В: R101.2 R104.2 R107.2
GND: C44.1 C45.1 C46.1 VT15.2(S) VT16.2(S) VT17.2(S)
INT1: R101.1 R102.1
INT2: R104.1 R105.1
INT3: R107.1 R108.1
MCU_INT1: R103.1 VT15.3(D)
MCU_INT2: R106.1 VT16.3(D)
MCU_INT3: R109.1 VT17.3(D)
NetC44_2: C44.2 R102.2 VT15.1(G)
NetC45_2: C45.2 R105.2 VT16.1(G)
NetC46_2: C46.2 R108.2 VT17.1(G)

### Notes on the sheet
- 11 (Лист 1, 3, 4, 5, 6, 7, 8, 9, 10, 12)
- Подп. и дата
- Инв. № дубл.
- Взам. инв. №
- Инв. № подл.
- Лист
- Изм.
- № докум.
- Подп.
- Дата
- Копировал
- Формат

### Library data of the parts
C44-C46 = Конденсатор кер.: Value: 0,1мк
R101-R109 = Резистор  0,05Вт: Резистор 0,05Вт; Power rating: 0,05Вт; Value: 100к
VT15-VT17 = mosfet-n: Name: 2N7002K

## Sheet РЕУН.468323.001_Laser_Interface.SchDoc: =Name-1str
size 840 x 594 mm; SheetNumber: 12; Вид изделия: Документация; Раздел: Документация; Код документа: Э3; Вид документа: Схема электрическая принципиальная; Класс документа: Конструкторский документ; Создавать изделие в PLM: Yes; DocumentCode: РЕУН.468323.001 Э3 2D; DocumentView: Схема электрическая принципиальная; DocumentClass: Конструкторский документ; ProductView: Документация; Format: А1
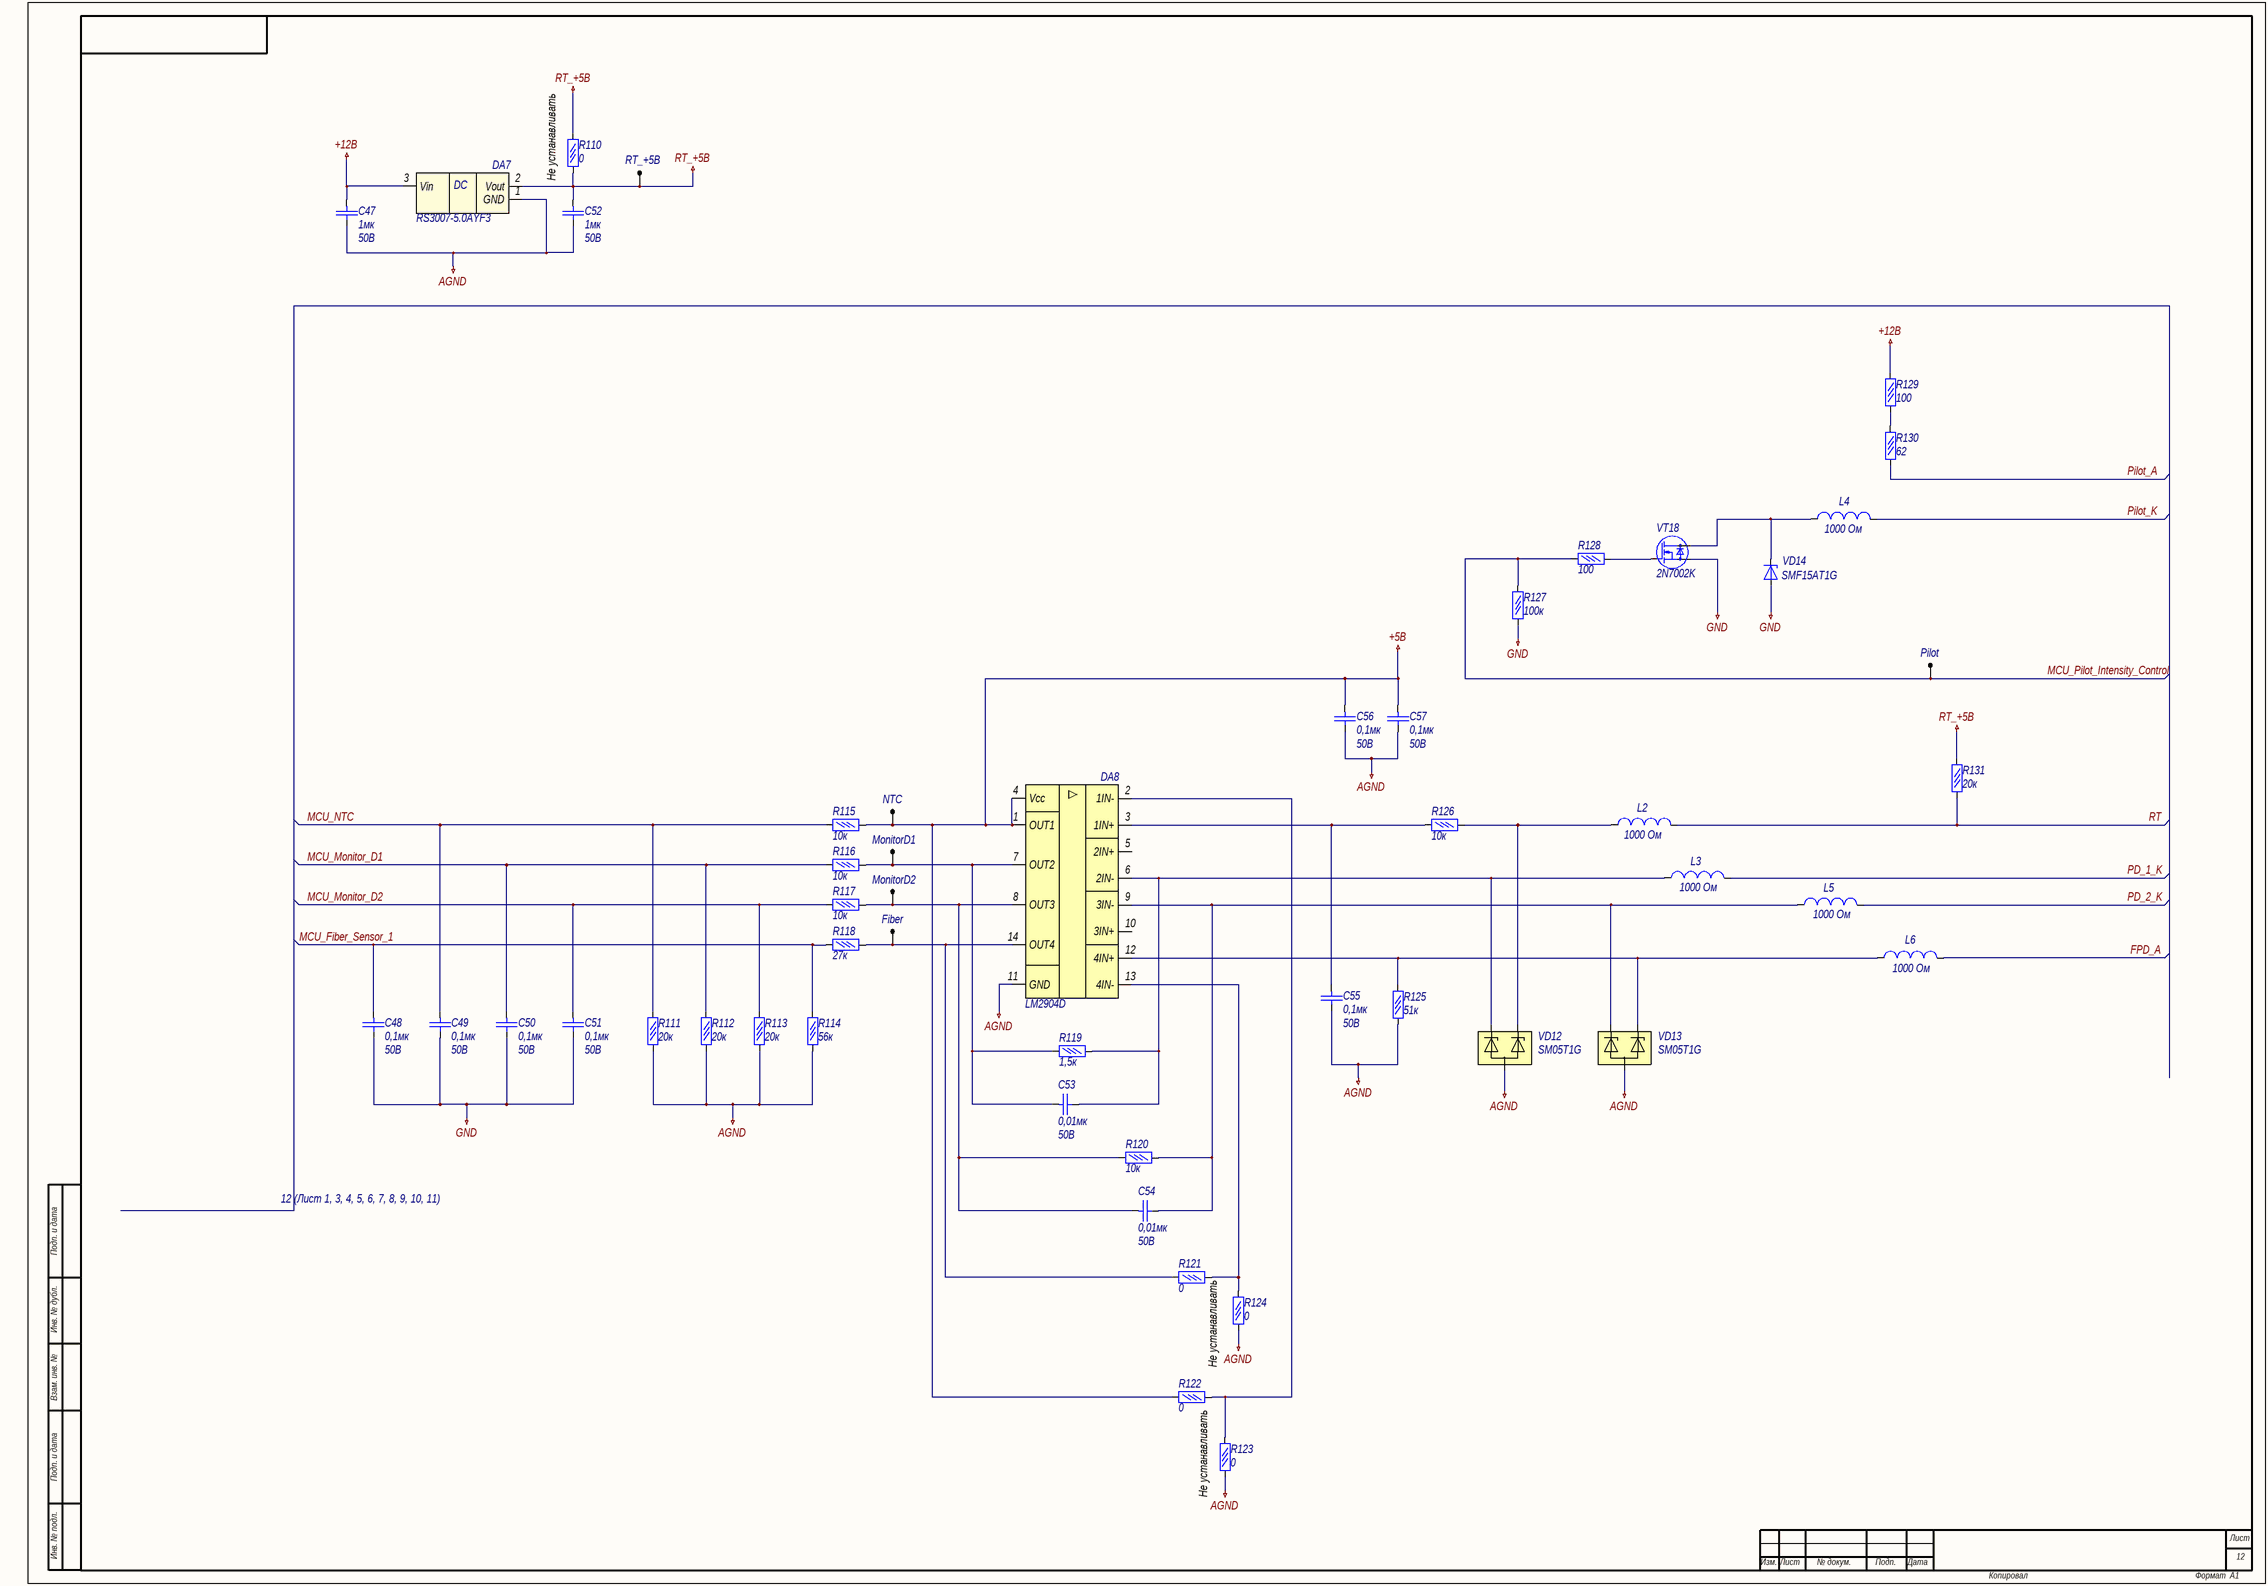
[diagram p11: РЕУН.468323.001_Laser_Interface.SchDoc]

### Parts
C47  Voltage: 50В  [C0805_AA]  (hidden comment: 1мк)
C48  Voltage: 50В  [C0805_AA]  (hidden comment: 0,1мк)
C49  Voltage: 50В  [C0805_AA]  (hidden comment: 0,1мк)
C50  Voltage: 50В  [C0805_AA]  (hidden comment: 0,1мк)
C51  Voltage: 50В  [C0805_AA]  (hidden comment: 0,1мк)
C52  Voltage: 50В  [C0805_AA]  (hidden comment: 1мк)
C53  Voltage: 50В  [C0805_AA]  (hidden comment: 0,01мк)
C54  Voltage: 50В  [C0805_AA]  (hidden comment: 0,01мк)
C55  Voltage: 50В  [C0805_AA]  (hidden comment: 0,1мк)
C56  Voltage: 50В  [C0805_AA]  (hidden comment: 0,1мк)
C57  Voltage: 50В  [C0805_AA]  (hidden comment: 0,1мк)
DA7  RS3007-5.0AYF3
DA8  LM2904D  [SO8_H]
Fiber  "1"  [0.5 x 1_round]  (value not drawn)
L2  1000 Ом  [L0603_A]
L3  1000 Ом  [L0603_A]
L4  1000 Ом  [L0603_A]
L5  1000 Ом  [L0603_A]
L6  1000 Ом  [L0603_A]
MonitorD1  "1"  [0.5 x 1_round]  (value not drawn)
MonitorD2  "1"  [0.5 x 1_round]  (value not drawn)
NTC  "1"  [0.5 x 1_round]  (value not drawn)
Pilot  "1"  [0.5 x 1_round]  (value not drawn)
R110  0  [R1206]
R111  20к  [R1206]
R112  20к  [R1206]
R113  20к  [R1206]
R114  56к  [R1206]
R115  10к  [R1206]
R116  10к  [R1206]
R117  10к  [R1206]
R118  27к  [R1206]
R119  1,5к  [R1206]
R120  10к  [R1206]
R121  0  [R1206]
R122  0  [R1206]
R123  0  [R1206]
R124  0  [R1206]
R125  51к  [R1206]
R126  10к  [R1206]
R127  100к  [R1206]
R128  100  [R1206]
R129  100  [R1206]
R130  62  [R1206]
R131  20к  [R1206]
RT_+5В  "1"  [0.5 x 1_round]  (value not drawn)
VD12  SM05T1G
VD13  SM05T1G
VD14  SMF15AT1G  [SOT23-2_A]
VT18  2N7002K  [SOT23-3]

### Nets
+5В: C56.2 C57.2 DA8.1(OUT1) DA8.4(Vcc) NTC.1 R115.2 R122.2
+12В: C47.2 DA7.3(Vin) R129.2
AGND: C47.1 C52.1 C55.1 C56.1 C57.1 DA7.1(GND) DA8.11(GND) R111.1 R112.1 R113.1 R114.1 R123.2 R124.2 R125.2 VD12.3 VD13.3
GND: C48.1 C49.1 C50.1 C51.1 R127.1 VD14.2(A) VT18.2(S)
RT_+5В: C52.2 DA7.2(Vout) R110.1 R110.2 R131.2 RT_+5В.1
FPD_A: L6.2
MCU_Fiber_Sensor_1: C48.2 R114.2 R118.1
MCU_Monitor_D1: C50.2 R112.2 R116.1
MCU_Monitor_D2: C51.2 R113.2 R117.1
MCU_NTC: C49.2 R111.2 R115.1
MCU_Pilot_Intensity_Control: Pilot.1 R127.2 R128.1
PD_1_K: L3.2
PD_2_K: L5.2
Pilot_A: R130.1
Pilot_K: L4.2
RT: L2.2 R131.1
NetC53_1: C53.1 DA8.6(2IN-) L3.1 R119.2 VD12.1
NetC53_2: C53.2 DA8.7(OUT2) MonitorD1.1 R116.2 R119.1
NetC54_1: C54.1 DA8.9(3IN-) L5.1 R120.2 VD13.1
NetC54_2: C54.2 DA8.8(OUT3) MonitorD2.1 R117.2 R120.1
NetC55_2: C55.2 DA8.3(1IN+) R126.1
NetDA8_2: DA8.2(1IN-) R122.1 R123.1
NetDA8_12: DA8.12(4IN+) L6.1 R125.1 VD13.2
NetDA8_13: DA8.13(4IN-) R121.1 R124.1
NetDA8_14: DA8.14(OUT4) Fiber.1 R118.2 R121.2
NetL2_1: L2.1 R126.2 VD12.2
NetL4_1: L4.1 VD14.1(K) VT18.3(D)
NetR128_2: R128.2 VT18.1(G)
NetR129_1: R129.1 R130.2

Not connected (* = marked no-connect by the designer): DA8 5(2IN+) 10(3IN+)

### Notes on the sheet
- (near R110) Не устанавливать
- 12 (Лист 1, 3, 4, 5, 6, 7, 8, 9, 10, 11)
- (near R121) Не устанавливать
- (near R122) Не устанавливать
- Подп. и дата
- Инв. № дубл.
- Взам. инв. №
- Инв. № подл.
- Лист
- Изм.
- № докум.
- Подп.
- Дата
- Копировал
- Формат
- (in symbol L78_1) DC

### Library data of the parts
C47-C57 = Конденсатор кер.
  C47 C52: Value: 1мк
  C48-C51 C55-C57: Value: 0,1мк
  C53 C54: Value: 0,01мк
DA7 = L78_1: Линейный стабилизатор напряжения
DA8 = LM2902D: ОУ; Name: LM2904D
Fiber MonitorD1 MonitorD2 NTC Pilot RT_+5В = TestPoint: Test point; Comment_1: "1"
L2-L6 = Inductor: Катушка индуктивности; Value: 1000 Ом
R110-R131 = Резистор  0,05Вт: Резистор 0,05Вт; Power rating: 0,05Вт
  R110 R121-R124: Value: 0
  R111-R113 R131: Value: 20к
  R114: Value: 56к
  R115-R117 R120 R126: Value: 10к
  R118: Value: 27к
  R119: Value: 1,5к
  R125: Value: 51к
  R127: Value: 100к
  R128 R129: Value: 100
  R130: Value: 62
VD12 VD13 = ZenerArray2: Сборка TVS-диодов; Parameter 1: *
VD14 = DiodeZener: Стабилитрон; Name: SMF15AT1G
VT18 = mosfet-n: Name: 2N7002K

## Nets that join several sheets
+3,3В: РЕУН.468323.001_Connectors (R12.1 R13.1 R17.2), РЕУН.468323.001_Power (+3,3В.1 C7.2 DA2.5 HL3.1), РЕУН.468323.001_Interface (12 pins), РЕУН.468323.001_Encoder (R30.2 R31.2), РЕУН.468323.001_LED_DRV_ISO_1 (DA4.10 DA4.12 R44.1 R45.2), РЕУН.468323.001_LED_DRV_ISO_2 (DA5.10 DA5.12 R61.1 R62.2), РЕУН.468323.001_LED_DRV_TEC (DA6.10 DA6.12 R78.1 R79.2), РЕУН.468323.001_USB-UART (DD5.6 DD5.7 R93.2 R95.2), РЕУН.468323.001_EEPROM (C43.2 DD6.8 R99.2 R100.2), РЕУН.468323.001_INT (R103.2 R106.2 R109.2)
+5В: РЕУН.468323.001_Connectors (X3.1 X11.10), РЕУН.468323.001_Power (6 pins), РЕУН.468323.001_Audio (C25.2 DA3.6), РЕУН.468323.001_LED_DRV_ISO_1 (C27.2 C28.1 DD2.16 R53.1), РЕУН.468323.001_LED_DRV_ISO_2 (C32.2 C33.1 DD3.16 R70.1), РЕУН.468323.001_LED_DRV_TEC (C37.2 C38.1 DD4.16 R87.1), РЕУН.468323.001_Laser_Interface (7 pins)
+5В_ISO_1: РЕУН.468323.001_Connectors (X12.5), РЕУН.468323.001_LED_DRV_ISO_1 (R46.1 R47.1 R55.1)
+5В_ISO_2: РЕУН.468323.001_Connectors (X13.5), РЕУН.468323.001_LED_DRV_ISO_2 (R63.1 R64.1 R72.1), РЕУН.468323.001_LED_DRV_TEC (R80.1 R81.1 R89.1)
+5В_USB: РЕУН.468323.001_Connectors (6 pins), РЕУН.468323.001_USB-UART (C42.2 R97.2)
+12В: РЕУН.468323.001_Connectors (R4.2 R5.2), РЕУН.468323.001_Power (5 pins), РЕУН.468323.001_INT (R101.2 R104.2 R107.2), РЕУН.468323.001_Laser_Interface (C47.2 DA7.3 R129.2)
+12В_Vin: РЕУН.468323.001_Connectors (X1.1 X10.1), РЕУН.468323.001_Power (FP1.1)
AGND: РЕУН.468323.001_Connectors (X11.6), РЕУН.468323.001_USB-UART (C42.1), РЕУН.468323.001_Laser_Interface (16 pins)
GND: РЕУН.468323.001_Connectors (28 pins), РЕУН.468323.001_Power (8 pins), РЕУН.468323.001_Interface (23 pins), РЕУН.468323.001_Encoder (11 pins), РЕУН.468323.001_Audio (5 pins), РЕУН.468323.001_LED_DRV_ISO_1 (5 pins), РЕУН.468323.001_LED_DRV_ISO_2 (5 pins), РЕУН.468323.001_LED_DRV_TEC (5 pins), РЕУН.468323.001_USB-UART (7 pins), РЕУН.468323.001_EEPROM (C43.1 DD6.4 R98.1), РЕУН.468323.001_INT (6 pins), РЕУН.468323.001_Laser_Interface (7 pins)
GND_ISO_1: РЕУН.468323.001_Connectors (X12.8), РЕУН.468323.001_LED_DRV_ISO_1 (7 pins)
GND_ISO_2: РЕУН.468323.001_Connectors (X13.8), РЕУН.468323.001_LED_DRV_ISO_2 (7 pins), РЕУН.468323.001_LED_DRV_TEC (7 pins)
A: РЕУН.468323.001_Connectors (X2.2), РЕУН.468323.001_Encoder (R30.1 R32.1)
B: РЕУН.468323.001_Connectors (X2.2), РЕУН.468323.001_Encoder (R31.1 R33.1)
B_K: РЕУН.468323.001_Connectors (X3.2), РЕУН.468323.001_Encoder (R29.1)
FPD_A: РЕУН.468323.001_Connectors (X11.10), РЕУН.468323.001_Laser_Interface (L6.2)
G_K: РЕУН.468323.001_Connectors (X3.2), РЕУН.468323.001_Encoder (R28.1)
LED_Fault_1: РЕУН.468323.001_Connectors (X12.7), РЕУН.468323.001_LED_DRV_ISO_1 (DD2.8 R41.1 R43.1)
LED_Fault_2: РЕУН.468323.001_Connectors (X13.7), РЕУН.468323.001_LED_DRV_ISO_2 (DD3.8 R58.1 R60.1)
LED_Interlock_1: РЕУН.468323.001_Connectors (X12.6), РЕУН.468323.001_LED_DRV_ISO_1 (DA4.14 DD2.7 R51.1)
LED_Interlock_2: РЕУН.468323.001_Connectors (X13.6), РЕУН.468323.001_LED_DRV_ISO_2 (DA5.14 DD3.7 R68.1)
LED_RS232_RX1: РЕУН.468323.001_Connectors (X12.4), РЕУН.468323.001_LED_DRV_ISO_1 (DD2.13)
LED_RS232_RX2: РЕУН.468323.001_Connectors (X13.4), РЕУН.468323.001_LED_DRV_ISO_2 (DD3.13)
LED_RS232_TX1: РЕУН.468323.001_Connectors (X12.2), РЕУН.468323.001_LED_DRV_ISO_1 (DD2.14)
LED_RS232_TX2: РЕУН.468323.001_Connectors (X13.2), РЕУН.468323.001_LED_DRV_ISO_2 (DD3.14)
LED_UART_RX1: РЕУН.468323.001_Connectors (X12.3), РЕУН.468323.001_LED_DRV_ISO_1 (R40.1 R42.1)
LED_UART_RX2: РЕУН.468323.001_Connectors (X13.3), РЕУН.468323.001_LED_DRV_ISO_2 (R57.1 R59.1)
MCU_Audio_SD: РЕУН.468323.001_Interface (DD1.52), РЕУН.468323.001_Audio (DA3.1)
MCU_Audio_SPK: РЕУН.468323.001_Interface (DD1.39), РЕУН.468323.001_Audio (R37.2)
MCU_Fiber_Sensor_1: РЕУН.468323.001_Interface (DD1.26), РЕУН.468323.001_Laser_Interface (C48.2 R114.2 R118.1)
MCU_INT1: РЕУН.468323.001_Interface (DD1.28), РЕУН.468323.001_INT (R103.1 VT15.3)
MCU_INT2: РЕУН.468323.001_Interface (DD1.55), РЕУН.468323.001_INT (R106.1 VT16.3)
MCU_INT3: РЕУН.468323.001_Interface (DD1.56), РЕУН.468323.001_INT (R109.1 VT17.3)
MCU_Interlock: РЕУН.468323.001_Connectors (R12.2 VT4.3), РЕУН.468323.001_Interface (DD1.2)
MCU_LED_B: РЕУН.468323.001_Connectors (R6.2 VT1.1), РЕУН.468323.001_Interface (DD1.29)
MCU_LED_Fault_1: РЕУН.468323.001_Interface (DD1.33), РЕУН.468323.001_LED_DRV_ISO_1 (DD2.9)
MCU_LED_Fault_2: РЕУН.468323.001_Interface (DD1.34), РЕУН.468323.001_LED_DRV_ISO_2 (DD3.9)
MCU_LED_G: РЕУН.468323.001_Connectors (R11.1 VT2.1), РЕУН.468323.001_Interface (DD1.15)
MCU_LED_Interlock_1: РЕУН.468323.001_Interface (DD1.35), РЕУН.468323.001_LED_DRV_ISO_1 (DD2.10)
MCU_LED_Interlock_2: РЕУН.468323.001_Interface (DD1.36), РЕУН.468323.001_LED_DRV_ISO_2 (DD3.10)
MCU_LED_R: РЕУН.468323.001_Connectors (R14.2 VT3.1), РЕУН.468323.001_Interface (DD1.14)
MCU_LED_USART_RX_1: РЕУН.468323.001_Interface (DD1.17), РЕУН.468323.001_LED_DRV_ISO_1 (DD2.12)
MCU_LED_USART_RX_2: РЕУН.468323.001_Interface (DD1.38), РЕУН.468323.001_LED_DRV_ISO_2 (DD3.12)
MCU_LED_USART_TX_1: РЕУН.468323.001_Interface (DD1.16), РЕУН.468323.001_LED_DRV_ISO_1 (DD2.11)
MCU_LED_USART_TX_2: РЕУН.468323.001_Interface (DD1.37), РЕУН.468323.001_LED_DRV_ISO_2 (DD3.11)
MCU_Monitor_D1: РЕУН.468323.001_Interface (DD1.23), РЕУН.468323.001_Laser_Interface (C50.2 R112.2 R116.1)
MCU_Monitor_D2: РЕУН.468323.001_Interface (DD1.22), РЕУН.468323.001_Laser_Interface (C51.2 R113.2 R117.1)
MCU_NTC: РЕУН.468323.001_Interface (DD1.8), РЕУН.468323.001_Laser_Interface (C49.2 R111.2 R115.1)
MCU_Pedal: РЕУН.468323.001_Connectors (R13.2 VT5.3), РЕУН.468323.001_Interface (DD1.51)
MCU_Pilot_Intensity_Control: РЕУН.468323.001_Interface (DD1.21), РЕУН.468323.001_Laser_Interface (Pilot.1 R127.2 R128.1)
MCU_SCL: РЕУН.468323.001_Interface (DD1.41), РЕУН.468323.001_EEPROM (DD6.5 R99.1 SCL.1)
MCU_SDA: РЕУН.468323.001_Interface (DD1.40), РЕУН.468323.001_EEPROM (DD6.6 R100.1 SDA.1)
MCU_TEC_Fault: РЕУН.468323.001_Interface (DD1.10), РЕУН.468323.001_LED_DRV_TEC (DD4.9)
MCU_TEC_Interlock: РЕУН.468323.001_Interface (DD1.9), РЕУН.468323.001_LED_DRV_TEC (DD4.10)
MCU_TEC_USART_RX: РЕУН.468323.001_Interface (DD1.54), РЕУН.468323.001_LED_DRV_TEC (DD4.12)
MCU_TEC_USART_TX: РЕУН.468323.001_Interface (DD1.53), РЕУН.468323.001_LED_DRV_TEC (DD4.11)
MCU_USB_Native_D_N: РЕУН.468323.001_Connectors (R15.1), РЕУН.468323.001_Interface (DD1.44)
MCU_USB_Native_D_P: РЕУН.468323.001_Connectors (R16.1), РЕУН.468323.001_Interface (DD1.45)
MCU_USB_RX: РЕУН.468323.001_Interface (DD1.43), РЕУН.468323.001_USB-UART (DD5.18)
MCU_USB_TX: РЕУН.468323.001_Interface (DD1.42), РЕУН.468323.001_USB-UART (DD5.17)
PD_1_K: РЕУН.468323.001_Connectors (X11.8), РЕУН.468323.001_Laser_Interface (L3.2)
PD_2_K: РЕУН.468323.001_Connectors (X11.9), РЕУН.468323.001_Laser_Interface (L5.2)
Pilot_A: РЕУН.468323.001_Connectors (X11.4), РЕУН.468323.001_Laser_Interface (R130.1)
Pilot_K: РЕУН.468323.001_Connectors (X11.5), РЕУН.468323.001_Laser_Interface (L4.2)
RT: РЕУН.468323.001_Connectors (X11.7), РЕУН.468323.001_Laser_Interface (L2.2 R131.1)
SPKN: РЕУН.468323.001_Connectors (X4.1), РЕУН.468323.001_Audio (DA3.8 VD10.1)
SPKP: РЕУН.468323.001_Connectors (X4.2), РЕУН.468323.001_Audio (DA3.5 VD10.2)
TEC_Fault: РЕУН.468323.001_Connectors (X14.7), РЕУН.468323.001_LED_DRV_TEC (DD4.8 R75.1 R77.1)
TEC_Interlock: РЕУН.468323.001_Connectors (X14.6), РЕУН.468323.001_LED_DRV_TEC (DA6.14 DD4.7 R85.1)
TEC_RS232_RX: РЕУН.468323.001_Connectors (X14.4), РЕУН.468323.001_LED_DRV_TEC (DD4.13)
TEC_RS232_TX: РЕУН.468323.001_Connectors (X14.2), РЕУН.468323.001_LED_DRV_TEC (DD4.14)
TEC_UART_RX: РЕУН.468323.001_Connectors (X14.3), РЕУН.468323.001_LED_DRV_TEC (R74.1 R76.1)
TEC_UART_TX: РЕУН.468323.001_Connectors (X14.1), РЕУН.468323.001_LED_DRV_TEC (DA6.16 R83.1)